# Altium project Low_Level_ECU.PrjPcb (part 3 of 6)

## Sheet 07-MCU PORTC_D.SchDoc: MCU2
size 420 x 297 mm; Revision: 1.0; SheetNumber: 7; SheetTotal: 13; Project: LOW LEVEL ECU
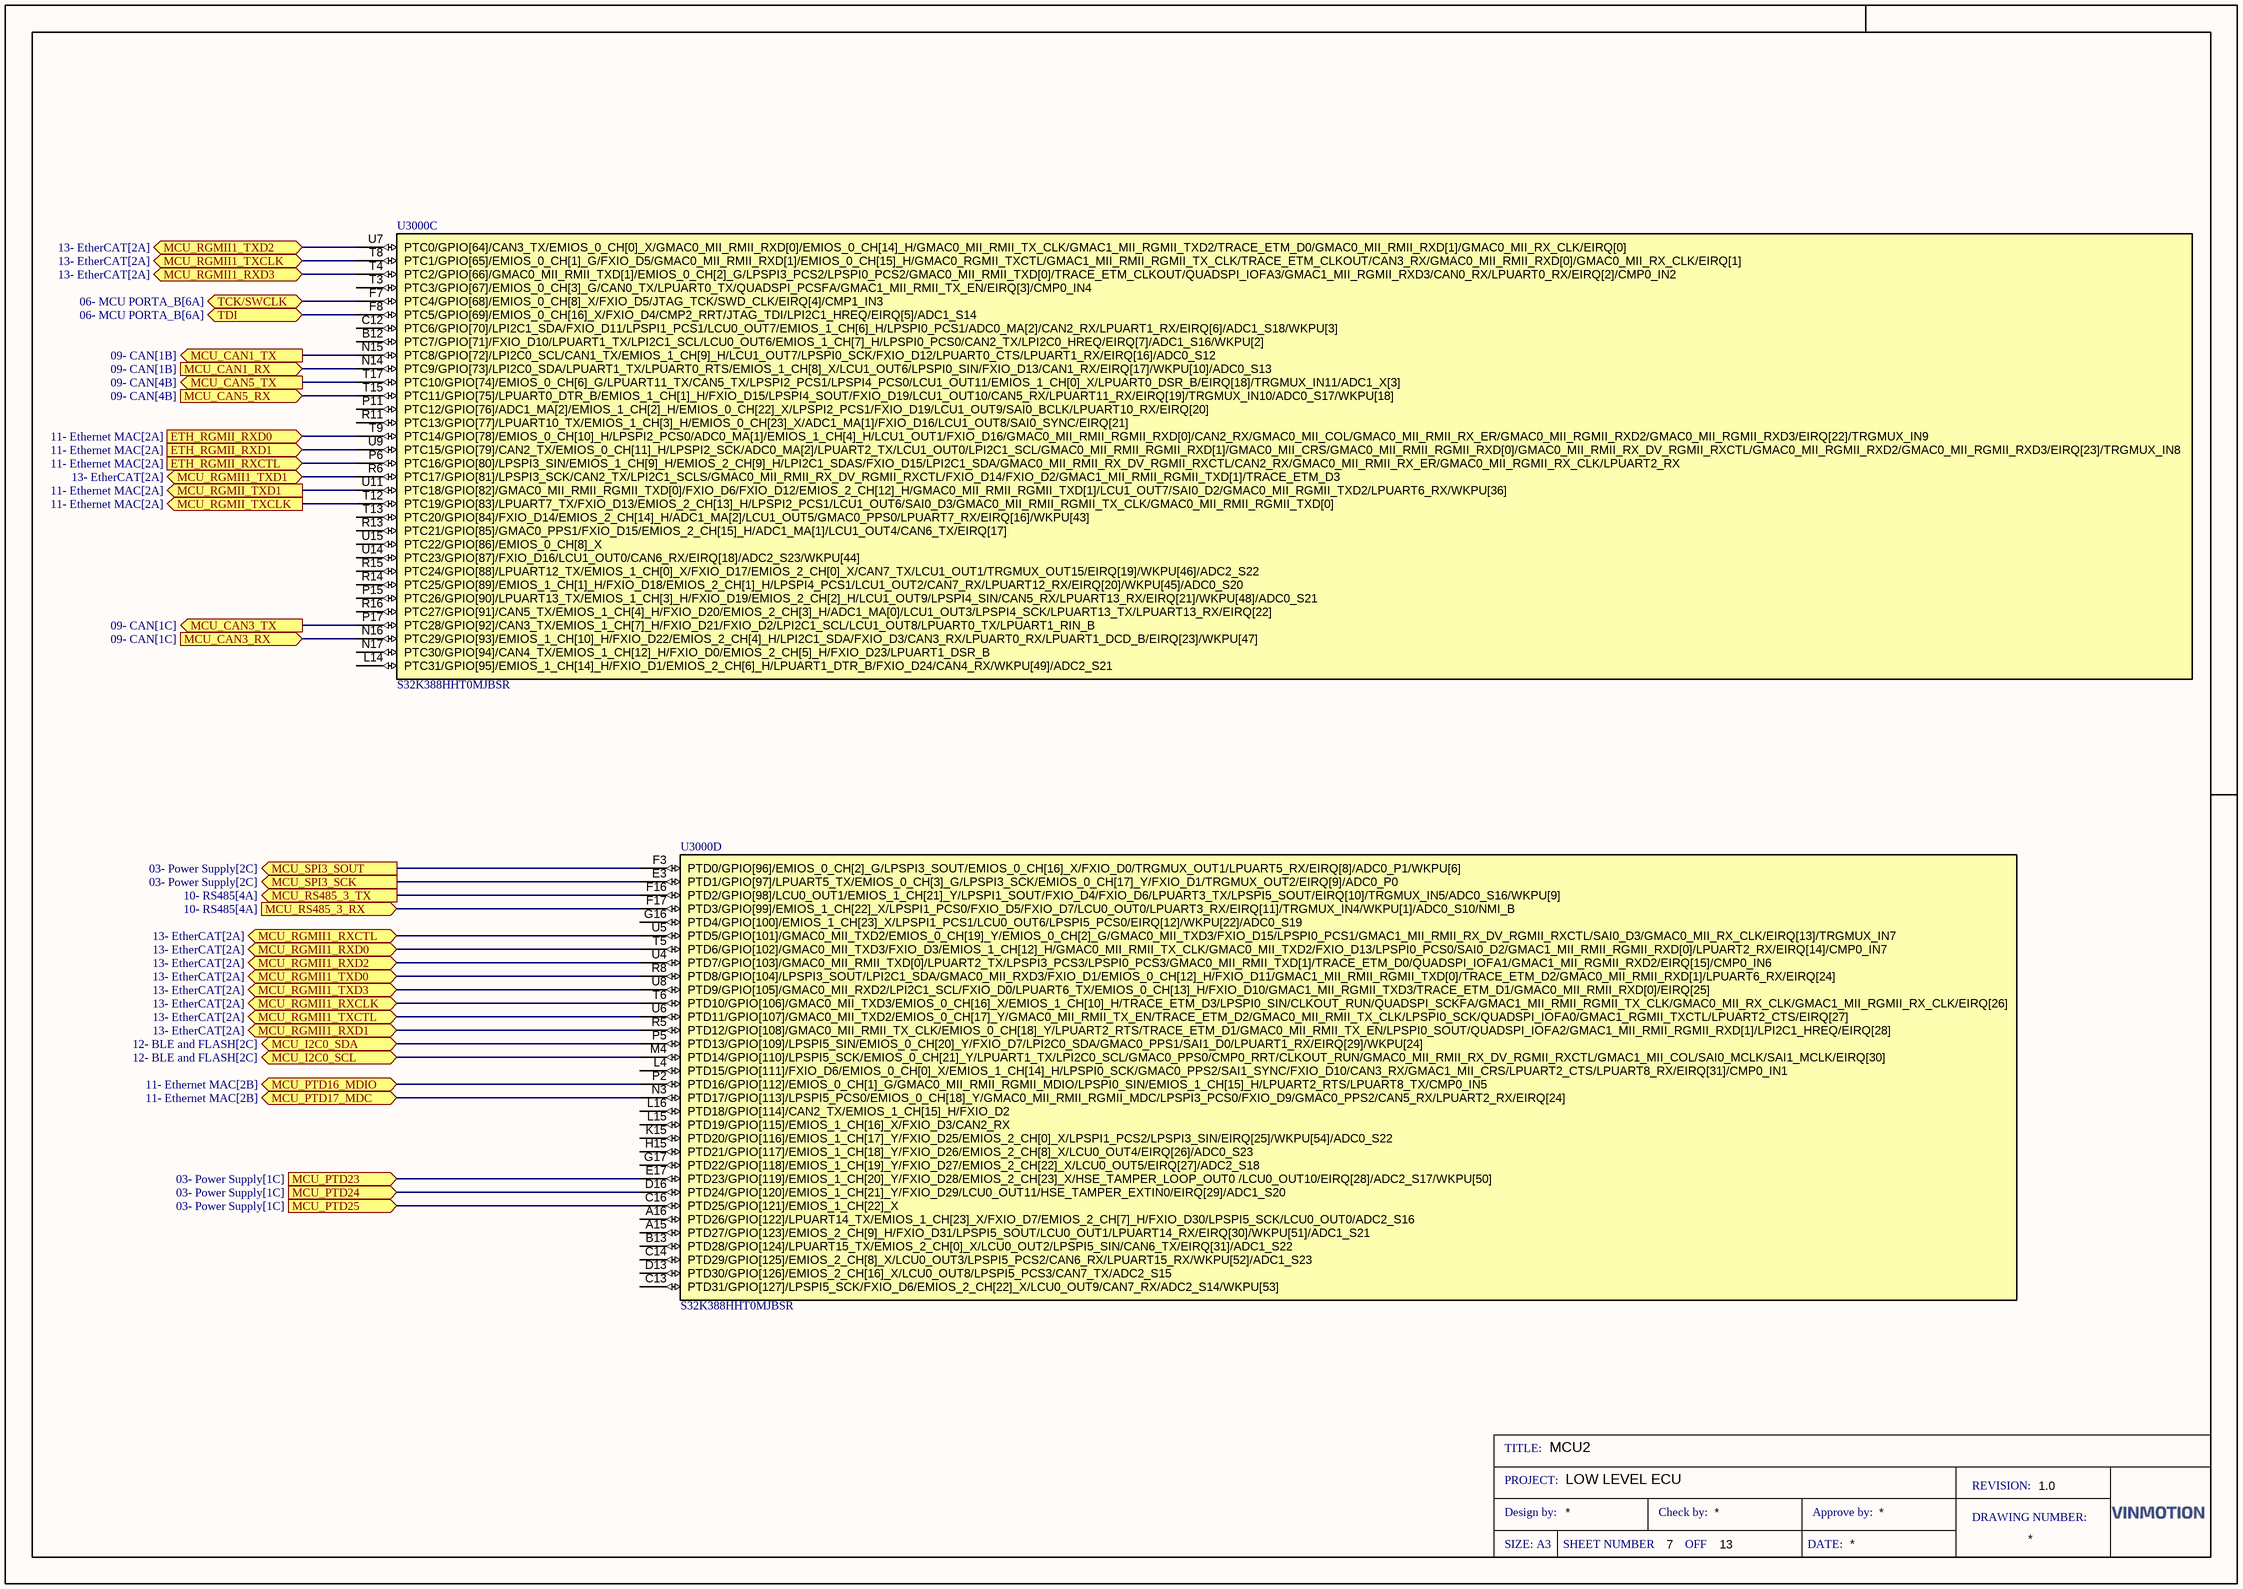
[diagram p5: 07-MCU PORTC_D.SchDoc]

### Parts
U3000  S32K388HHT0MJBSR  [BGA289C80P17X17_1400X1400X152]  (parts C,D of 9)

### Ports
ETH_RGMII_RXCTL (in, see 11- Ethernet MAC[2A]), ETH_RGMII_RXD0 (in, see 11- Ethernet MAC[2A]), ETH_RGMII_RXD1 (in, see 11- Ethernet MAC[2A]), MCU_CAN1_RX (in, see 09- CAN[1B]), MCU_CAN1_TX (out, see 09- CAN[1B]), MCU_CAN3_RX (in, see 09- CAN[1C]), MCU_CAN3_TX (out, see 09- CAN[1C]), MCU_CAN5_RX (in, see 09- CAN[4B]), MCU_CAN5_TX (out, see 09- CAN[4B]), MCU_I2C0_SCL (bidir, see 12- BLE and FLASH[2C]), MCU_I2C0_SDA (bidir, see 12- BLE and FLASH[2C]), MCU_PTD16_MDIO (bidir, see 11- Ethernet MAC[2B]), MCU_PTD17_MDC (bidir, see 11- Ethernet MAC[2B]), MCU_PTD23 (in, see 03- Power Supply[1C]), MCU_PTD24 (in, see 03- Power Supply[1C]), MCU_PTD25 (in, see 03- Power Supply[1C]), MCU_RGMII1_RXCLK (bidir, see 13- EtherCAT[2A]), MCU_RGMII1_RXCTL (bidir, see 13- EtherCAT[2A]), MCU_RGMII1_RXD0 (bidir, see 13- EtherCAT[2A]), MCU_RGMII1_RXD1 (bidir, see 13- EtherCAT[2A]), MCU_RGMII1_RXD2 (bidir, see 13- EtherCAT[2A]), MCU_RGMII1_RXD3 (bidir, see 13- EtherCAT[2A]), MCU_RGMII1_TXCLK (bidir, see 13- EtherCAT[2A]), MCU_RGMII1_TXCTL (bidir, see 13- EtherCAT[2A]), MCU_RGMII1_TXD0 (bidir, see 13- EtherCAT[2A]), MCU_RGMII1_TXD1 (bidir, see 13- EtherCAT[2A]), MCU_RGMII1_TXD2 (bidir, see 13- EtherCAT[2A]), MCU_RGMII1_TXD3 (bidir, see 13- EtherCAT[2A]), MCU_RGMII_TXCLK (out, see 11- Ethernet MAC[2A]), MCU_RGMII_TXD1 (out, see 11- Ethernet MAC[2A]), MCU_RS485_3_RX (in, see 10- RS485[4A]), MCU_RS485_3_TX (out, see 10- RS485[4A]), MCU_SPI3_SCK (out, see 03- Power Supply[2C]), MCU_SPI3_SOUT (out, see 03- Power Supply[2C]), TCK/SWCLK (bidir, see 06- MCU PORTA_B[6A]), TDI (bidir, see 06- MCU PORTA_B[6A])

### Nets
TCK/SWCLK: U3000.F7(PTC4/GPIO[68]/EMIOS_0_CH[8]_X/FXIO_D5/JTAG_TCK/SWD_CLK/EIRQ[4]/CMP1_IN3) ; port TCK/SWCLK
TDI: U3000.F8(PTC5/GPIO[69]/EMIOS_0_CH[16]_X/FXIO_D4/CMP2_RRT/JTAG_TDI/LPI2C1_HREQ/EIRQ[5]/ADC1_S14) ; port TDI
NetC1045_1: U3000.E17(PTD23/GPIO[119]/EMIOS_1_CH[20]_Y/FXIO_D28/EMIOS_2_CH[23]_X/HSE_TAMPER_LOOP_OUT0_/LCU0_OUT10/EIRQ[28]/ADC2_S17/WKPU[50]) ; port MCU_PTD23
NetC1046_1: U3000.D16(PTD24/GPIO[120]/EMIOS_1_CH[21]_Y/FXIO_D29/LCU0_OUT11/HSE_TAMPER_EXTIN0/EIRQ[29]/ADC1_S20) ; port MCU_PTD24
NetC1048_1: U3000.C16(PTD25/GPIO[121]/EMIOS_1_CH[22]_X) ; port MCU_PTD25
NetR1012_1: U3000.F3(PTD0/GPIO[96]/EMIOS_0_CH[2]_G/LPSPI3_SOUT/EMIOS_0_CH[16]_X/FXIO_D0/TRGMUX_OUT1/LPUART5_RX/EIRQ[8]/ADC0_P1/WKPU[6]) ; port MCU_SPI3_SOUT
NetR1013_1: U3000.E3(PTD1/GPIO[97]/LPUART5_TX/EMIOS_0_CH[3]_G/LPSPI3_SCK/EMIOS_0_CH[17]_Y/FXIO_D1/TRGMUX_OUT2/EIRQ[9]/ADC0_P0) ; port MCU_SPI3_SCK
NetR6001_1: U3000.P6(PTC16/GPIO[80]/LPSPI3_SIN/EMIOS_1_CH[9]_H/EMIOS_2_CH[9]_H/LPI2C1_SDAS/FXIO_D15/LPI2C1_SDA/GMAC0_MII_RMII_RX_DV_RGMII_RXCTL/CAN2_RX/GMAC0_MII_RMII_RX_ER/GMAC0_MII_RGMII_RX_CLK/LPUART2_RX) ; port ETH_RGMII_RXCTL
NetR6004_1: U3000.U9(PTC15/GPIO[79]/CAN2_TX/EMIOS_0_CH[11]_H/LPSPI2_SCK/ADC0_MA[2]/LPUART2_TX/LCU1_OUT0/LPI2C1_SCL/GMAC0_MII_RMII_RGMII_RXD[1]/GMAC0_MII_CRS/GMAC0_MII_RMII_RGMII_RXD[0]/GMAC0_MII_RMII_RX_DV_RGMII_RXCTL/GMAC0_MII_RGMII_RXD2/GMAC0_MII_RGMII_RXD3/EIRQ[23]/TRGMUX_IN8) ; port ETH_RGMII_RXD1
NetR6005_1: U3000.T9(PTC14/GPIO[78]/EMIOS_0_CH[10]_H/LPSPI2_PCS0/ADC0_MA[1]/EMIOS_1_CH[4]_H/LCU1_OUT1/FXIO_D16/GMAC0_MII_RMII_RGMII_RXD[0]/CAN2_RX/GMAC0_MII_COL/GMAC0_MII_RMII_RX_ER/GMAC0_MII_RGMII_RXD2/GMAC0_MII_RGMII_RXD3/EIRQ[22]/TRGMUX_IN9) ; port ETH_RGMII_RXD0
NetR6006_1: U3000.T12(PTC19/GPIO[83]/LPUART7_TX/FXIO_D13/EMIOS_2_CH[13]_H/LPSPI2_PCS1/LCU1_OUT6/SAI0_D3/GMAC0_MII_RMII_RGMII_TX_CLK/GMAC0_MII_RMII_RGMII_TXD[0]) ; port MCU_RGMII_TXCLK
NetR6010_1: U3000.U11(PTC18/GPIO[82]/GMAC0_MII_RMII_RGMII_TXD[0]/FXIO_D6/FXIO_D12/EMIOS_2_CH[12]_H/GMAC0_MII_RMII_RGMII_TXD[1]/LCU1_OUT7/SAI0_D2/GMAC0_MII_RGMII_TXD2/LPUART6_RX/WKPU[36]) ; port MCU_RGMII_TXD1
NetR6017_1: U3000.P2(PTD16/GPIO[112]/EMIOS_0_CH[1]_G/GMAC0_MII_RMII_RGMII_MDIO/LPSPI0_SIN/EMIOS_1_CH[15]_H/LPUART2_RTS/LPUART8_TX/CMP0_IN5) ; port MCU_PTD16_MDIO
NetR6021_1: U3000.N3(PTD17/GPIO[113]/LPSPI5_PCS0/EMIOS_0_CH[18]_Y/GMAC0_MII_RMII_RGMII_MDC/LPSPI3_PCS0/FXIO_D9/GMAC0_PPS2/CAN5_RX/LPUART2_RX/EIRQ[24]) ; port MCU_PTD17_MDC
NetR7016_1: U3000.P5(PTD13/GPIO[109]/LPSPI5_SIN/EMIOS_0_CH[20]_Y/FXIO_D7/LPI2C0_SDA/GMAC0_PPS1/SAI1_D0/LPUART1_RX/EIRQ[29]/WKPU[24]) ; port MCU_I2C0_SDA
NetR7017_1: U3000.M4(PTD14/GPIO[110]/LPSPI5_SCK/EMIOS_0_CH[21]_Y/LPUART1_TX/LPI2C0_SCL/GMAC0_PPS0/CMP0_RRT/CLKOUT_RUN/GMAC0_MII_RMII_RX_DV_RGMII_RXCTL/GMAC1_MII_COL/SAI0_MCLK/SAI1_MCLK/EIRQ[30]) ; port MCU_I2C0_SCL
NetR8000_1: U3000.T8(PTC1/GPIO[65]/EMIOS_0_CH[1]_G/FXIO_D5/GMAC0_MII_RMII_RXD[1]/EMIOS_0_CH[15]_H/GMAC0_RGMII_TXCTL/GMAC1_MII_RMII_RGMII_TX_CLK/TRACE_ETM_CLKOUT/CAN3_RX/GMAC0_MII_RMII_RXD[0]/GMAC0_MII_RX_CLK/EIRQ[1]) ; port MCU_RGMII1_TXCLK
NetR8001_1: U3000.U6(PTD11/GPIO[107]/GMAC0_MII_TXD2/EMIOS_0_CH[17]_Y/GMAC0_MII_RMII_TX_EN/TRACE_ETM_D2/GMAC0_MII_RMII_TX_CLK/LPSPI0_SCK/QUADSPI_IOFA0/GMAC1_RGMII_TXCTL/LPUART2_CTS/EIRQ[27]) ; port MCU_RGMII1_TXCTL
NetR8002_1: U3000.R8(PTD8/GPIO[104]/LPSPI3_SOUT/LPI2C1_SDA/GMAC0_MII_RXD3/FXIO_D1/EMIOS_0_CH[12]_H/FXIO_D11/GMAC1_MII_RMII_RGMII_TXD[0]/TRACE_ETM_D2/GMAC0_MII_RMII_RXD[1]/LPUART6_RX/EIRQ[24]) ; port MCU_RGMII1_TXD0
NetR8003_1: U3000.R6(PTC17/GPIO[81]/LPSPI3_SCK/CAN2_TX/LPI2C1_SCLS/GMAC0_MII_RMII_RX_DV_RGMII_RXCTL/FXIO_D14/FXIO_D2/GMAC1_MII_RMII_RGMII_TXD[1]/TRACE_ETM_D3) ; port MCU_RGMII1_TXD1
NetR8004_1: U3000.U7(PTC0/GPIO[64]/CAN3_TX/EMIOS_0_CH[0]_X/GMAC0_MII_RMII_RXD[0]/EMIOS_0_CH[14]_H/GMAC0_MII_RMII_TX_CLK/GMAC1_MII_RGMII_TXD2/TRACE_ETM_D0/GMAC0_MII_RMII_RXD[1]/GMAC0_MII_RX_CLK/EIRQ[0]) ; port MCU_RGMII1_TXD2
NetR8005_1: U3000.U8(PTD9/GPIO[105]/GMAC0_MII_RXD2/LPI2C1_SCL/FXIO_D0/LPUART6_TX/EMIOS_0_CH[13]_H/FXIO_D10/GMAC1_MII_RGMII_TXD3/TRACE_ETM_D1/GMAC0_MII_RMII_RXD[0]/EIRQ[25]) ; port MCU_RGMII1_TXD3
NetR8006_1: U3000.T6(PTD10/GPIO[106]/GMAC0_MII_TXD3/EMIOS_0_CH[16]_X/EMIOS_1_CH[10]_H/TRACE_ETM_D3/LPSPI0_SIN/CLKOUT_RUN/QUADSPI_SCKFA/GMAC1_MII_RMII_RGMII_TX_CLK/GMAC0_MII_RX_CLK/GMAC1_MII_RGMII_RX_CLK/EIRQ[26]) ; port MCU_RGMII1_RXCLK
NetR8007_1: U3000.U5(PTD5/GPIO[101]/GMAC0_MII_TXD2/EMIOS_0_CH[19]_Y/EMIOS_0_CH[2]_G/GMAC0_MII_TXD3/FXIO_D15/LPSPI0_PCS1/GMAC1_MII_RMII_RX_DV_RGMII_RXCTL/SAI0_D3/GMAC0_MII_RX_CLK/EIRQ[13]/TRGMUX_IN7) ; port MCU_RGMII1_RXCTL
NetR8008_1: U3000.T5(PTD6/GPIO[102]/GMAC0_MII_TXD3/FXIO_D3/EMIOS_1_CH[12]_H/GMAC0_MII_RMII_TX_CLK/GMAC0_MII_TXD2/FXIO_D13/LPSPI0_PCS0/SAI0_D2/GMAC1_MII_RMII_RGMII_RXD[0]/LPUART2_RX/EIRQ[14]/CMP0_IN7) ; port MCU_RGMII1_RXD0
NetR8009_1: U3000.R5(PTD12/GPIO[108]/GMAC0_MII_RMII_TX_CLK/EMIOS_0_CH[18]_Y/LPUART2_RTS/TRACE_ETM_D1/GMAC0_MII_RMII_TX_EN/LPSPI0_SOUT/QUADSPI_IOFA2/GMAC1_MII_RMII_RGMII_RXD[1]/LPI2C1_HREQ/EIRQ[28]) ; port MCU_RGMII1_RXD1
NetR8010_1: U3000.U4(PTD7/GPIO[103]/GMAC0_MII_RMII_TXD[0]/LPUART2_TX/LPSPI3_PCS3/LPSPI0_PCS3/GMAC0_MII_RMII_TXD[1]/TRACE_ETM_D0/QUADSPI_IOFA1/GMAC1_MII_RGMII_RXD2/EIRQ[15]/CMP0_IN6) ; port MCU_RGMII1_RXD2
NetR8011_1: U3000.T4(PTC2/GPIO[66]/GMAC0_MII_RMII_TXD[1]/EMIOS_0_CH[2]_G/LPSPI3_PCS2/LPSPI0_PCS2/GMAC0_MII_RMII_TXD[0]/TRACE_ETM_CLKOUT/QUADSPI_IOFA3/GMAC1_MII_RGMII_RXD3/CAN0_RX/LPUART0_RX/EIRQ[2]/CMP0_IN2) ; port MCU_RGMII1_RXD3
NetU3000_F16: U3000.F16(PTD2/GPIO[98]/LCU0_OUT1/EMIOS_1_CH[21]_Y/LPSPI1_SOUT/FXIO_D4/FXIO_D6/LPUART3_TX/LPSPI5_SOUT/EIRQ[10]/TRGMUX_IN5/ADC0_S16/WKPU[9]) ; port MCU_RS485_3_TX
NetU3000_F17: U3000.F17(PTD3/GPIO[99]/EMIOS_1_CH[22]_X/LPSPI1_PCS0/FXIO_D5/FXIO_D7/LCU0_OUT0/LPUART3_RX/EIRQ[11]/TRGMUX_IN4/WKPU[1]/ADC0_S10/NMI_B) ; port MCU_RS485_3_RX
NetU3000_N14: U3000.N14(PTC9/GPIO[73]/LPI2C0_SDA/LPUART1_TX/LPUART0_RTS/EMIOS_1_CH[8]_X/LCU1_OUT6/LPSPI0_SIN/FXIO_D13/CAN1_RX/EIRQ[17]/WKPU[10]/ADC0_S13) ; port MCU_CAN1_RX
NetU3000_N15: U3000.N15(PTC8/GPIO[72]/LPI2C0_SCL/CAN1_TX/EMIOS_1_CH[9]_H/LCU1_OUT7/LPSPI0_SCK/FXIO_D12/LPUART0_CTS/LPUART1_RX/EIRQ[16]/ADC0_S12) ; port MCU_CAN1_TX
NetU3000_N16: U3000.N16(PTC29/GPIO[93]/EMIOS_1_CH[10]_H/FXIO_D22/EMIOS_2_CH[4]_H/LPI2C1_SDA/FXIO_D3/CAN3_RX/LPUART0_RX/LPUART1_DCD_B/EIRQ[23]/WKPU[47]) ; port MCU_CAN3_RX
NetU3000_P17: U3000.P17(PTC28/GPIO[92]/CAN3_TX/EMIOS_1_CH[7]_H/FXIO_D21/FXIO_D2/LPI2C1_SCL/LCU1_OUT8/LPUART0_TX/LPUART1_RIN_B) ; port MCU_CAN3_TX
NetU3000_T15: U3000.T15(PTC11/GPIO[75]/LPUART0_DTR_B/EMIOS_1_CH[1]_H/FXIO_D15/LPSPI4_SOUT/FXIO_D19/LCU1_OUT10/CAN5_RX/LPUART11_RX/EIRQ[19]/TRGMUX_IN10/ADC0_S17/WKPU[18]) ; port MCU_CAN5_RX
NetU3000_T17: U3000.T17(PTC10/GPIO[74]/EMIOS_0_CH[6]_G/LPUART11_TX/CAN5_TX/LPSPI2_PCS1/LPSPI4_PCS0/LCU1_OUT11/EMIOS_1_CH[0]_X/LPUART0_DSR_B/EIRQ[18]/TRGMUX_IN11/ADC1_X[3]) ; port MCU_CAN5_TX

Not connected (* = marked no-connect by the designer): U3000 A15(PTD27/GPIO[123]/EMIOS_2_CH[9]_H/FXIO_D31/LPSPI5_SOUT/LCU0_OUT1/LPUART14_RX/EIRQ[30]/WKPU[51]/ADC1_S21) A16(PTD26/GPIO[122]/LPUART14_TX/EMIOS_1_CH[23]_X/FXIO_D7/EMIOS_2_CH[7]_H/FXIO_D30/LPSPI5_SCK/LCU0_OUT0/ADC2_S16) B12(PTC7/GPIO[71]/FXIO_D10/LPUART1_TX/LPI2C1_SCL/LCU0_OUT6/EMIOS_1_CH[7]_H/LPSPI0_PCS0/CAN2_TX/LPI2C0_HREQ/EIRQ[7]/ADC1_S16/WKPU[2]) B13(PTD28/GPIO[124]/LPUART15_TX/EMIOS_2_CH[0]_X/LCU0_OUT2/LPSPI5_SIN/CAN6_TX/EIRQ[31]/ADC1_S22) C12(PTC6/GPIO[70]/LPI2C1_SDA/FXIO_D11/LPSPI1_PCS1/LCU0_OUT7/EMIOS_1_CH[6]_H/LPSPI0_PCS1/ADC0_MA[2]/CAN2_RX/LPUART1_RX/EIRQ[6]/ADC1_S18/WKPU[3]) C13(PTD31/GPIO[127]/LPSPI5_SCK/FXIO_D6/EMIOS_2_CH[22]_X/LCU0_OUT9/CAN7_RX/ADC2_S14/WKPU[53]) C14(PTD29/GPIO[125]/EMIOS_2_CH[8]_X/LCU0_OUT3/LPSPI5_PCS2/CAN6_RX/LPUART15_RX/WKPU[52]/ADC1_S23) D13(PTD30/GPIO[126]/EMIOS_2_CH[16]_X/LCU0_OUT8/LPSPI5_PCS3/CAN7_TX/ADC2_S15) G16(PTD4/GPIO[100]/EMIOS_1_CH[23]_X/LPSPI1_PCS1/LCU0_OUT6/LPSPI5_PCS0/EIRQ[12]/WKPU[22]/ADC0_S19) G17(PTD22/GPIO[118]/EMIOS_1_CH[19]_Y/FXIO_D27/EMIOS_2_CH[22]_X/LCU0_OUT5/EIRQ[27]/ADC2_S18) H15(PTD21/GPIO[117]/EMIOS_1_CH[18]_Y/FXIO_D26/EMIOS_2_CH[8]_X/LCU0_OUT4/EIRQ[26]/ADC0_S23) K15(PTD20/GPIO[116]/EMIOS_1_CH[17]_Y/FXIO_D25/EMIOS_2_CH[0]_X/LPSPI1_PCS2/LPSPI3_SIN/EIRQ[25]/WKPU[54]/ADC0_S22) L4(PTD15/GPIO[111]/FXIO_D6/EMIOS_0_CH[0]_X/EMIOS_1_CH[14]_H/LPSPI0_SCK/GMAC0_PPS2/SAI1_SYNC/FXIO_D10/CAN3_RX/GMAC1_MII_CRS/LPUART2_CTS/LPUART8_RX/EIRQ[31]/CMP0_IN1) L14(PTC31/GPIO[95]/EMIOS_1_CH[14]_H/FXIO_D1/EMIOS_2_CH[6]_H/LPUART1_DTR_B/FXIO_D24/CAN4_RX/WKPU[49]/ADC2_S21) L15(PTD19/GPIO[115]/EMIOS_1_CH[16]_X/FXIO_D3/CAN2_RX) L16(PTD18/GPIO[114]/CAN2_TX/EMIOS_1_CH[15]_H/FXIO_D2) N17(PTC30/GPIO[94]/CAN4_TX/EMIOS_1_CH[12]_H/FXIO_D0/EMIOS_2_CH[5]_H/FXIO_D23/LPUART1_DSR_B) P11(PTC12/GPIO[76]/ADC1_MA[2]/EMIOS_1_CH[2]_H/EMIOS_0_CH[22]_X/LPSPI2_PCS1/FXIO_D19/LCU1_OUT9/SAI0_BCLK/LPUART10_RX/EIRQ[20]) P15(PTC26/GPIO[90]/LPUART13_TX/EMIOS_1_CH[3]_H/FXIO_D19/EMIOS_2_CH[2]_H/LCU1_OUT9/LPSPI4_SIN/CAN5_RX/LPUART13_RX/EIRQ[21]/WKPU[48]/ADC0_S21) R11(PTC13/GPIO[77]/LPUART10_TX/EMIOS_1_CH[3]_H/EMIOS_0_CH[23]_X/ADC1_MA[1]/FXIO_D16/LCU1_OUT8/SAI0_SYNC/EIRQ[21]) R13(PTC21/GPIO[85]/GMAC0_PPS1/FXIO_D15/EMIOS_2_CH[15]_H/ADC1_MA[1]/LCU1_OUT4/CAN6_TX/EIRQ[17]) R14(PTC25/GPIO[89]/EMIOS_1_CH[1]_H/FXIO_D18/EMIOS_2_CH[1]_H/LPSPI4_PCS1/LCU1_OUT2/CAN7_RX/LPUART12_RX/EIRQ[20]/WKPU[45]/ADC0_S20) R15(PTC24/GPIO[88]/LPUART12_TX/EMIOS_1_CH[0]_X/FXIO_D17/EMIOS_2_CH[0]_X/CAN7_TX/LCU1_OUT1/TRGMUX_OUT15/EIRQ[19]/WKPU[46]/ADC2_S22) R16(PTC27/GPIO[91]/CAN5_TX/EMIOS_1_CH[4]_H/FXIO_D20/EMIOS_2_CH[3]_H/ADC1_MA[0]/LCU1_OUT3/LPSPI4_SCK/LPUART13_TX/LPUART13_RX/EIRQ[22]) T3(PTC3/GPIO[67]/EMIOS_0_CH[3]_G/CAN0_TX/LPUART0_TX/QUADSPI_PCSFA/GMAC1_MII_RMII_TX_EN/EIRQ[3]/CMP0_IN4) T13(PTC20/GPIO[84]/FXIO_D14/EMIOS_2_CH[14]_H/ADC1_MA[2]/LCU1_OUT5/GMAC0_PPS0/LPUART7_RX/EIRQ[16]/WKPU[43]) U14(PTC23/GPIO[87]/FXIO_D16/LCU1_OUT0/CAN6_RX/EIRQ[18]/ADC2_S23/WKPU[44]) U15(PTC22/GPIO[86]/EMIOS_0_CH[8]_X)

### Notes on the sheet
- TITLE:
- PROJECT:
- Design by:
- Check by:
- Approve by:
- DRAWING NUMBER:
- REVISION:
- SIZE: A3
- SHEET NUMBER
- OFF
- DATE:

### Library data of the parts
U3000 = CMP-01150-1: ARM® Cortex®-M7F S32K3 Microcontroller IC 32-Bit 5-Core 320MHz 8MB (8M x 8) FLASH 289-LFBGA (14x14); Manufacturer: NXP Semiconductors; Category: Microcontrollers; Manufacturer Part Number: S32K388HHT0MJBSR

## Sheet 08- MCU PORTE_F_G.SchDoc: MCU1
size 420 x 297 mm; Revision: 1.0; SheetNumber: 8; SheetTotal: 13; Project: LOW LEVEL ECU
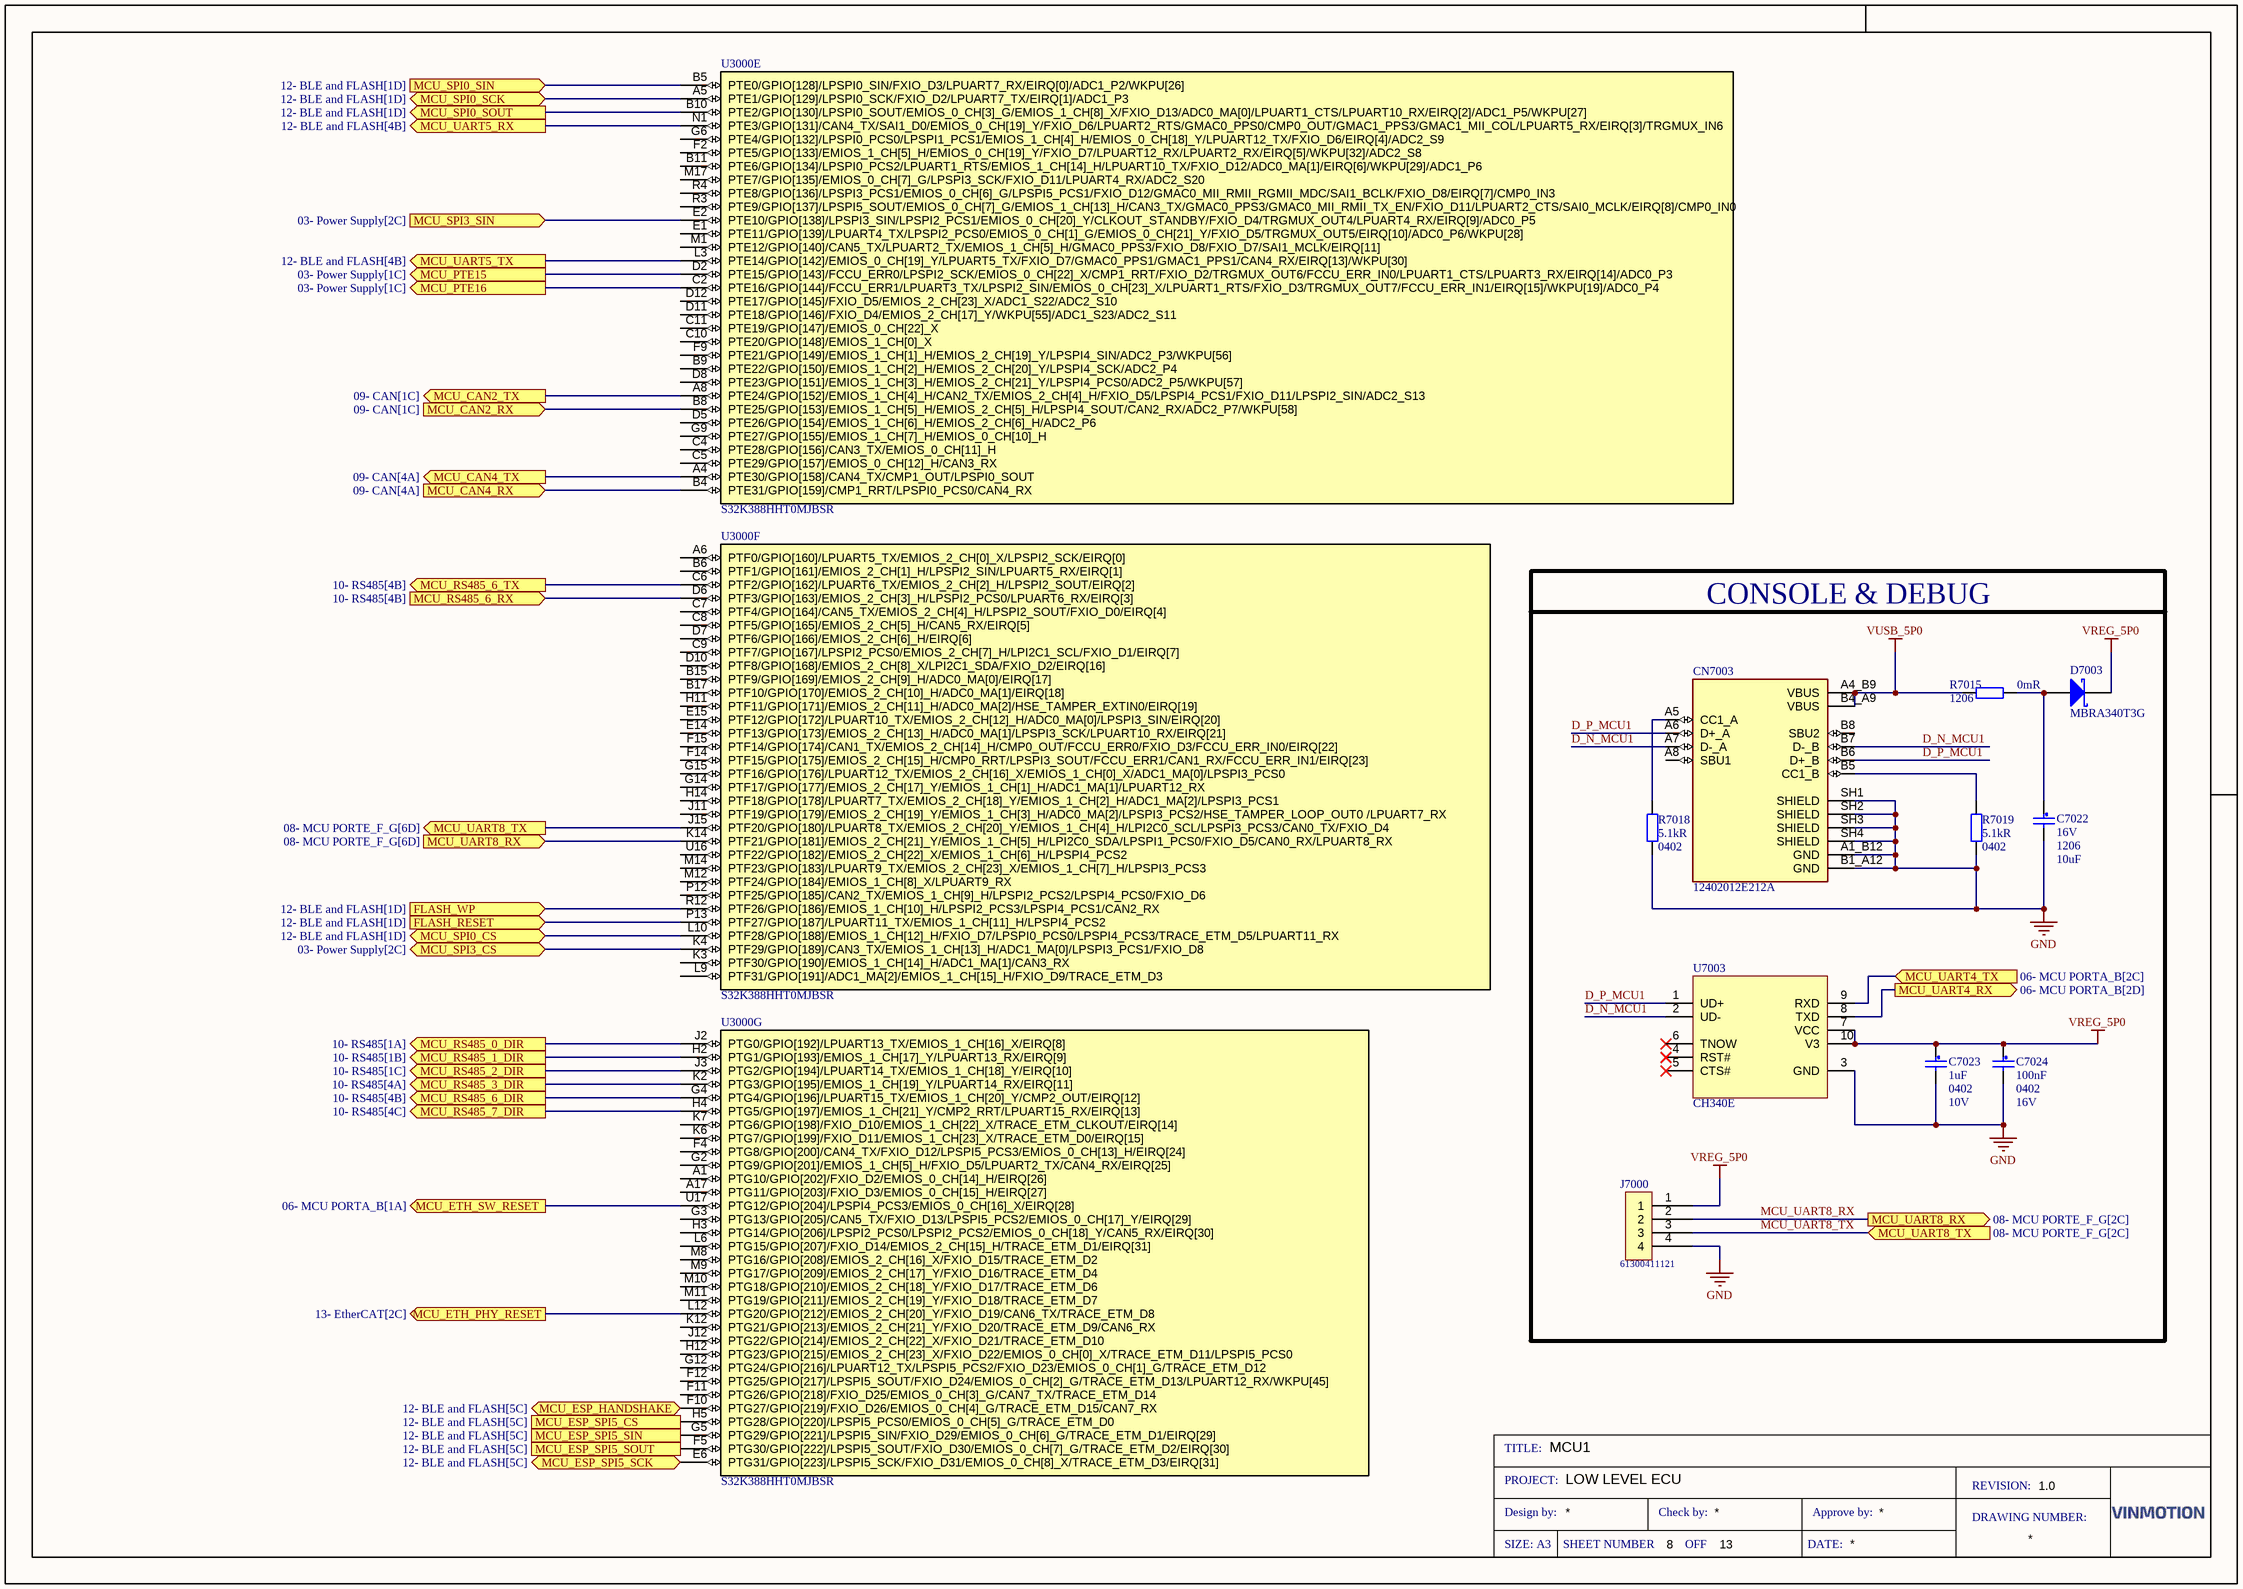
[diagram p6: 08- MCU PORTE_F_G.SchDoc]

### Parts
C7022  Voltage Rating: 16V  Case/Package: 1206  Capacitance: 10uF  [CAP1206]  (hidden comment: CL31B106KOHVPNE)
C7023  value 1uF  Case/Package: 0402  Rated DC Voltage (URdc): 10V  [CAP0402]  (hidden comment: CL05X105KP5NNNC)
C7024  Capacitance: 100nF  Case/Package: 0402  Voltage Rating (DC): 16V  [CAP0402]  (hidden comment: 0402YC104KAT2A)
CN7003  12402012E212A  [USB_TYPE_C]
D7003  MBRA340T3G  [ON_SMA_NRVBA340T3G_N]
J7000  61300411121  [WURTH_61300411121_R]
R7015  Resistance: 0mR  Case/Package: 1206  [RES1206]  (hidden comment: AC1206JR-070RL)
R7018  Resistance: 5.1kR  Case/Package: 0402  [RES0402]  (hidden comment: MCR01MZPF5101)
R7019  Resistance: 5.1kR  Case/Package: 0402  [RES0402]  (hidden comment: MCR01MZPF5101)
U3000  S32K388HHT0MJBSR  [BGA289C80P17X17_1400X1400X152]  (parts E,F,G of 9)
U7003  CH340E  [CH340E]

### Blocks framed on the sheet
CONSOLE & DEBUG: C7022-C7024 CN7003 D7003 J7000 R7015 R7018 R7019 U7003

### Ports
FLASH_RESET (in, see 12- BLE and FLASH[1D]), FLASH_WP (in, see 12- BLE and FLASH[1D]), MCU_CAN2_RX (in, see 09- CAN[1C]), MCU_CAN2_TX (out, see 09- CAN[1C]), MCU_CAN4_RX (in, see 09- CAN[4A]), MCU_CAN4_TX (out, see 09- CAN[4A]), MCU_ESP_HANDSHAKE (bidir, see 12- BLE and FLASH[5C]), MCU_ESP_SPI5_CS (out, see 12- BLE and FLASH[5C]), MCU_ESP_SPI5_SCK (bidir, see 12- BLE and FLASH[5C]), MCU_ESP_SPI5_SIN (in, see 12- BLE and FLASH[5C]), MCU_ESP_SPI5_SOUT (out, see 12- BLE and FLASH[5C]), MCU_ETH_PHY_RESET (out, see 13- EtherCAT[2C]), MCU_ETH_SW_RESET (out, see 06- MCU PORTA_B[1A]), MCU_PTE15 (out, see 03- Power Supply[1C]), MCU_PTE16 (out, see 03- Power Supply[1C]), MCU_RS485_0_DIR (out, see 10- RS485[1A]), MCU_RS485_1_DIR (out, see 10- RS485[1B]), MCU_RS485_2_DIR (out, see 10- RS485[1C]), MCU_RS485_3_DIR (out, see 10- RS485[4A]), MCU_RS485_6_DIR (out, see 10- RS485[4B]), MCU_RS485_6_RX (in, see 10- RS485[4B]), MCU_RS485_6_TX (out, see 10- RS485[4B]), MCU_RS485_7_DIR (out, see 10- RS485[4C]), MCU_SPI0_CS (bidir, see 12- BLE and FLASH[1D]), MCU_SPI0_SCK (bidir, see 12- BLE and FLASH[1D]), MCU_SPI0_SIN (in, see 12- BLE and FLASH[1D]), MCU_SPI0_SOUT (out, see 12- BLE and FLASH[1D]), MCU_SPI3_CS (bidir, see 03- Power Supply[2C]), MCU_SPI3_SIN (in, see 03- Power Supply[2C]), MCU_UART4_RX (out, see 06- MCU PORTA_B[2D]), MCU_UART4_TX (in, see 06- MCU PORTA_B[2C]), MCU_UART5_RX (out, see 12- BLE and FLASH[4B]), MCU_UART5_TX (out, see 12- BLE and FLASH[4B]), MCU_UART8_RX (in, see 08- MCU PORTE_F_G[6D]), MCU_UART8_RX (out, see 08- MCU PORTE_F_G[2C]), MCU_UART8_TX (in, see 08- MCU PORTE_F_G[2C]), MCU_UART8_TX (out, see 08- MCU PORTE_F_G[6D])

### Nets
GND: C7022.2 C7023.2 C7024.2 CN7003.A1_B12(GND) CN7003.B1_A12(GND) CN7003.SH1(SHIELD) CN7003.SH2(SHIELD) CN7003.SH3(SHIELD) CN7003.SH4(SHIELD) J7000.4 R7018.1 R7019.1 U7003.3(GND)
VREG_5P0: C7023.1 C7024.1 D7003.1(K) J7000.1 U7003.7(VCC) U7003.10(V3)
VUSB_5P0: CN7003.A4_B9(VBUS) CN7003.B4_A9(VBUS) R7015.1
D_N_MCU1: CN7003.A7(D-_A) CN7003.B7(D-_B) U7003.2(UD-)
D_P_MCU1: CN7003.A6(D+_A) CN7003.B6(D+_B) U7003.1(UD+)
MCU_UART8_RX: J7000.2 U3000.K14(PTF21/GPIO[181]/EMIOS_2_CH[21]_Y/EMIOS_1_CH[5]_H/LPI2C0_SDA/LPSPI1_PCS0/FXIO_D5/CAN0_RX/LPUART8_RX) ; port MCU_UART8_RX
MCU_UART8_TX: J7000.3 U3000.J15(PTF20/GPIO[180]/LPUART8_TX/EMIOS_2_CH[20]_Y/EMIOS_1_CH[4]_H/LPI2C0_SCL/LPSPI3_PCS3/CAN0_TX/FXIO_D4) ; port MCU_UART8_TX
NetC7022_1: C7022.1 D7003.2(A) R7015.2
NetCN7003_A5: CN7003.A5(CC1_A) R7018.2
NetCN7003_B5: CN7003.B5(CC1_B) R7019.2
NetR1011_1: U3000.E2(PTE10/GPIO[138]/LPSPI3_SIN/LPSPI2_PCS1/EMIOS_0_CH[20]_Y/CLKOUT_STANDBY/FXIO_D4/TRGMUX_OUT4/LPUART4_RX/EIRQ[9]/ADC0_P5) ; port MCU_SPI3_SIN
NetR1014_1: U3000.K4(PTF29/GPIO[189]/CAN3_TX/EMIOS_1_CH[13]_H/ADC1_MA[0]/LPSPI3_PCS1/FXIO_D8) ; port MCU_SPI3_CS
NetR1015_1: U3000.C2(PTE16/GPIO[144]/FCCU_ERR1/LPUART3_TX/LPSPI2_SIN/EMIOS_0_CH[23]_X/LPUART1_RTS/FXIO_D3/TRGMUX_OUT7/FCCU_ERR_IN1/EIRQ[15]/WKPU[19]/ADC0_P4) ; port MCU_PTE16
NetR1028_2: U3000.D2(PTE15/GPIO[143]/FCCU_ERR0/LPSPI2_SCK/EMIOS_0_CH[22]_X/CMP1_RRT/FXIO_D2/TRGMUX_OUT6/FCCU_ERR_IN0/LPUART1_CTS/LPUART3_RX/EIRQ[14]/ADC0_P3) ; port MCU_PTE15
NetR3007_1: U3000.U17(PTG12/GPIO[204]/LPSPI4_PCS3/EMIOS_0_CH[16]_X/EIRQ[28]) ; port MCU_ETH_SW_RESET
NetR5002_2: U3000.J2(PTG0/GPIO[192]/LPUART13_TX/EMIOS_1_CH[16]_X/EIRQ[8]) ; port MCU_RS485_0_DIR
NetR5003_2: U3000.K2(PTG3/GPIO[195]/EMIOS_1_CH[19]_Y/LPUART14_RX/EIRQ[11]) ; port MCU_RS485_3_DIR
NetR5006_2: U3000.H2(PTG1/GPIO[193]/EMIOS_1_CH[17]_Y/LPUART13_RX/EIRQ[9]) ; port MCU_RS485_1_DIR
NetR5007_2: U3000.G4(PTG4/GPIO[196]/LPUART15_TX/EMIOS_1_CH[20]_Y/CMP2_OUT/EIRQ[12]) ; port MCU_RS485_6_DIR
NetR5010_2: U3000.J3(PTG2/GPIO[194]/LPUART14_TX/EMIOS_1_CH[18]_Y/EIRQ[10]) ; port MCU_RS485_2_DIR
NetR5011_2: U3000.H4(PTG5/GPIO[197]/EMIOS_1_CH[21]_Y/CMP2_RRT/LPUART15_RX/EIRQ[13]) ; port MCU_RS485_7_DIR
NetR8040_1: U3000.L12(PTG20/GPIO[212]/EMIOS_2_CH[20]_Y/FXIO_D19/CAN6_TX/TRACE_ETM_D8) ; port MCU_ETH_PHY_RESET
NetU3000_A4: U3000.A4(PTE30/GPIO[158]/CAN4_TX/CMP1_OUT/LPSPI0_SOUT) ; port MCU_CAN4_TX
NetU3000_A5: U3000.A5(PTE1/GPIO[129]/LPSPI0_SCK/FXIO_D2/LPUART7_TX/EIRQ[1]/ADC1_P3) ; port MCU_SPI0_SCK
NetU3000_A8: U3000.A8(PTE24/GPIO[152]/EMIOS_1_CH[4]_H/CAN2_TX/EMIOS_2_CH[4]_H/FXIO_D5/LPSPI4_PCS1/FXIO_D11/LPSPI2_SIN/ADC2_S13) ; port MCU_CAN2_TX
NetU3000_B4: U3000.B4(PTE31/GPIO[159]/CMP1_RRT/LPSPI0_PCS0/CAN4_RX) ; port MCU_CAN4_RX
NetU3000_B5: U3000.B5(PTE0/GPIO[128]/LPSPI0_SIN/FXIO_D3/LPUART7_RX/EIRQ[0]/ADC1_P2/WKPU[26]) ; port MCU_SPI0_SIN
NetU3000_B8: U3000.B8(PTE25/GPIO[153]/EMIOS_1_CH[5]_H/EMIOS_2_CH[5]_H/LPSPI4_SOUT/CAN2_RX/ADC2_P7/WKPU[58]) ; port MCU_CAN2_RX
NetU3000_B10: U3000.B10(PTE2/GPIO[130]/LPSPI0_SOUT/EMIOS_0_CH[3]_G/EMIOS_1_CH[8]_X/FXIO_D13/ADC0_MA[0]/LPUART1_CTS/LPUART10_RX/EIRQ[2]/ADC1_P5/WKPU[27]) ; port MCU_SPI0_SOUT
NetU3000_C6: U3000.C6(PTF2/GPIO[162]/LPUART6_TX/EMIOS_2_CH[2]_H/LPSPI2_SOUT/EIRQ[2]) ; port MCU_RS485_6_TX
NetU3000_D6: U3000.D6(PTF3/GPIO[163]/EMIOS_2_CH[3]_H/LPSPI2_PCS0/LPUART6_RX/EIRQ[3]) ; port MCU_RS485_6_RX
NetU3000_E6: U3000.E6(PTG31/GPIO[223]/LPSPI5_SCK/FXIO_D31/EMIOS_0_CH[8]_X/TRACE_ETM_D3/EIRQ[31]) ; port MCU_ESP_SPI5_SCK
NetU3000_F5: U3000.F5(PTG30/GPIO[222]/LPSPI5_SOUT/FXIO_D30/EMIOS_0_CH[7]_G/TRACE_ETM_D2/EIRQ[30]) ; port MCU_ESP_SPI5_SOUT
NetU3000_F10: U3000.F10(PTG27/GPIO[219]/FXIO_D26/EMIOS_0_CH[4]_G/TRACE_ETM_D15/CAN7_RX) ; port MCU_ESP_HANDSHAKE
NetU3000_G5: U3000.G5(PTG29/GPIO[221]/LPSPI5_SIN/FXIO_D29/EMIOS_0_CH[6]_G/TRACE_ETM_D1/EIRQ[29]) ; port MCU_ESP_SPI5_SIN
NetU3000_H5: U3000.H5(PTG28/GPIO[220]/LPSPI5_PCS0/EMIOS_0_CH[5]_G/TRACE_ETM_D0) ; port MCU_ESP_SPI5_CS
NetU3000_K16: U7003.8(TXD) ; port MCU_UART4_RX
NetU3000_K17: U7003.9(RXD) ; port MCU_UART4_TX
NetU3000_L3: U3000.L3(PTE14/GPIO[142]/EMIOS_0_CH[19]_Y/LPUART5_TX/FXIO_D7/GMAC0_PPS1/GMAC1_PPS1/CAN4_RX/EIRQ[13]/WKPU[30]) ; port MCU_UART5_TX
NetU3000_L10: U3000.L10(PTF28/GPIO[188]/EMIOS_1_CH[12]_H/FXIO_D7/LPSPI0_PCS0/LPSPI4_PCS3/TRACE_ETM_D5/LPUART11_RX) ; port MCU_SPI0_CS
NetU3000_N1: U3000.N1(PTE3/GPIO[131]/CAN4_TX/SAI1_D0/EMIOS_0_CH[19]_Y/FXIO_D6/LPUART2_RTS/GMAC0_PPS0/CMP0_OUT/GMAC1_PPS3/GMAC1_MII_COL/LPUART5_RX/EIRQ[3]/TRGMUX_IN6) ; port MCU_UART5_RX
NetU3000_P13: U3000.P13(PTF27/GPIO[187]/LPUART11_TX/EMIOS_1_CH[11]_H/LPSPI4_PCS2) ; port FLASH_RESET
NetU3000_R12: U3000.R12(PTF26/GPIO[186]/EMIOS_1_CH[10]_H/LPSPI2_PCS3/LPSPI4_PCS1/CAN2_RX) ; port FLASH_WP

Not connected (* = marked no-connect by the designer): CN7003 A8(SBU1) B8(SBU2); U3000 A1(PTG10/GPIO[202]/FXIO_D2/EMIOS_0_CH[14]_H/EIRQ[26]) A6(PTF0/GPIO[160]/LPUART5_TX/EMIOS_2_CH[0]_X/LPSPI2_SCK/EIRQ[0]) A17(PTG11/GPIO[203]/FXIO_D3/EMIOS_0_CH[15]_H/EIRQ[27]) B6(PTF1/GPIO[161]/EMIOS_2_CH[1]_H/LPSPI2_SIN/LPUART5_RX/EIRQ[1]) B9(PTE22/GPIO[150]/EMIOS_1_CH[2]_H/EMIOS_2_CH[20]_Y/LPSPI4_SCK/ADC2_P4) B11(PTE6/GPIO[134]/LPSPI0_PCS2/LPUART1_RTS/EMIOS_1_CH[14]_H/LPUART10_TX/FXIO_D12/ADC0_MA[1]/EIRQ[6]/WKPU[29]/ADC1_P6) B15(PTF9/GPIO[169]/EMIOS_2_CH[9]_H/ADC0_MA[0]/EIRQ[17]) B17(PTF10/GPIO[170]/EMIOS_2_CH[10]_H/ADC0_MA[1]/EIRQ[18]) C4(PTE28/GPIO[156]/CAN3_TX/EMIOS_0_CH[11]_H) C5(PTE29/GPIO[157]/EMIOS_0_CH[12]_H/CAN3_RX) C7(PTF4/GPIO[164]/CAN5_TX/EMIOS_2_CH[4]_H/LPSPI2_SOUT/FXIO_D0/EIRQ[4]) C8(PTF5/GPIO[165]/EMIOS_2_CH[5]_H/CAN5_RX/EIRQ[5]) C9(PTF7/GPIO[167]/LPSPI2_PCS0/EMIOS_2_CH[7]_H/LPI2C1_SCL/FXIO_D1/EIRQ[7]) C10(PTE20/GPIO[148]/EMIOS_1_CH[0]_X) C11(PTE19/GPIO[147]/EMIOS_0_CH[22]_X) D5(PTE26/GPIO[154]/EMIOS_1_CH[6]_H/EMIOS_2_CH[6]_H/ADC2_P6) D7(PTF6/GPIO[166]/EMIOS_2_CH[6]_H/EIRQ[6]) D8(PTE23/GPIO[151]/EMIOS_1_CH[3]_H/EMIOS_2_CH[21]_Y/LPSPI4_PCS0/ADC2_P5/WKPU[57]) D10(PTF8/GPIO[168]/EMIOS_2_CH[8]_X/LPI2C1_SDA/FXIO_D2/EIRQ[16]) D11(PTE18/GPIO[146]/FXIO_D4/EMIOS_2_CH[17]_Y/WKPU[55]/ADC1_S23/ADC2_S11) D12(PTE17/GPIO[145]/FXIO_D5/EMIOS_2_CH[23]_X/ADC1_S22/ADC2_S10) E1(PTE11/GPIO[139]/LPUART4_TX/LPSPI2_PCS0/EMIOS_0_CH[1]_G/EMIOS_0_CH[21]_Y/FXIO_D5/TRGMUX_OUT5/EIRQ[10]/ADC0_P6/WKPU[28]) E14(PTF13/GPIO[173]/EMIOS_2_CH[13]_H/ADC0_MA[1]/LPSPI3_SCK/LPUART10_RX/EIRQ[21]) E15(PTF12/GPIO[172]/LPUART10_TX/EMIOS_2_CH[12]_H/ADC0_MA[0]/LPSPI3_SIN/EIRQ[20]) F2(PTE5/GPIO[133]/EMIOS_1_CH[5]_H/EMIOS_0_CH[19]_Y/FXIO_D7/LPUART12_RX/LPUART2_RX/EIRQ[5]/WKPU[32]/ADC2_S8) F4(PTG8/GPIO[200]/CAN4_TX/FXIO_D12/LPSPI5_PCS3/EMIOS_0_CH[13]_H/EIRQ[24]) F9(PTE21/GPIO[149]/EMIOS_1_CH[1]_H/EMIOS_2_CH[19]_Y/LPSPI4_SIN/ADC2_P3/WKPU[56]) F11(PTG26/GPIO[218]/FXIO_D25/EMIOS_0_CH[3]_G/CAN7_TX/TRACE_ETM_D14) F12(PTG25/GPIO[217]/LPSPI5_SOUT/FXIO_D24/EMIOS_0_CH[2]_G/TRACE_ETM_D13/LPUART12_RX/WKPU[45]) F14(PTF15/GPIO[175]/EMIOS_2_CH[15]_H/CMP0_RRT/LPSPI3_SOUT/FCCU_ERR1/CAN1_RX/FCCU_ERR_IN1/EIRQ[23]) F15(PTF14/GPIO[174]/CAN1_TX/EMIOS_2_CH[14]_H/CMP0_OUT/FCCU_ERR0/FXIO_D3/FCCU_ERR_IN0/EIRQ[22]) G2(PTG9/GPIO[201]/EMIOS_1_CH[5]_H/FXIO_D5/LPUART2_TX/CAN4_RX/EIRQ[25]) G3(PTG13/GPIO[205]/CAN5_TX/FXIO_D13/LPSPI5_PCS2/EMIOS_0_CH[17]_Y/EIRQ[29]) G6(PTE4/GPIO[132]/LPSPI0_PCS0/LPSPI1_PCS1/EMIOS_1_CH[4]_H/EMIOS_0_CH[18]_Y/LPUART12_TX/FXIO_D6/EIRQ[4]/ADC2_S9) G9(PTE27/GPIO[155]/EMIOS_1_CH[7]_H/EMIOS_0_CH[10]_H) G12(PTG24/GPIO[216]/LPUART12_TX/LPSPI5_PCS2/FXIO_D23/EMIOS_0_CH[1]_G/TRACE_ETM_D12) G14(PTF17/GPIO[177]/EMIOS_2_CH[17]_Y/EMIOS_1_CH[1]_H/ADC1_MA[1]/LPUART12_RX) G15(PTF16/GPIO[176]/LPUART12_TX/EMIOS_2_CH[16]_X/EMIOS_1_CH[0]_X/ADC1_MA[0]/LPSPI3_PCS0) H3(PTG14/GPIO[206]/LPSPI2_PCS0/LPSPI2_PCS2/EMIOS_0_CH[18]_Y/CAN5_RX/EIRQ[30]) H11(PTF11/GPIO[171]/EMIOS_2_CH[11]_H/ADC0_MA[2]/HSE_TAMPER_EXTIN0/EIRQ[19]) H12(PTG23/GPIO[215]/EMIOS_2_CH[23]_X/FXIO_D22/EMIOS_0_CH[0]_X/TRACE_ETM_D11/LPSPI5_PCS0) H14(PTF18/GPIO[178]/LPUART7_TX/EMIOS_2_CH[18]_Y/EMIOS_1_CH[2]_H/ADC1_MA[2]/LPSPI3_PCS1) J11(PTF19/GPIO[179]/EMIOS_2_CH[19]_Y/EMIOS_1_CH[3]_H/ADC0_MA[2]/LPSPI3_PCS2/HSE_TAMPER_LOOP_OUT0_/LPUART7_RX) J12(PTG22/GPIO[214]/EMIOS_2_CH[22]_X/FXIO_D21/TRACE_ETM_D10) K3(PTF30/GPIO[190]/EMIOS_1_CH[14]_H/ADC1_MA[1]/CAN3_RX) K6(PTG7/GPIO[199]/FXIO_D11/EMIOS_1_CH[23]_X/TRACE_ETM_D0/EIRQ[15]) K7(PTG6/GPIO[198]/FXIO_D10/EMIOS_1_CH[22]_X/TRACE_ETM_CLKOUT/EIRQ[14]) K12(PTG21/GPIO[213]/EMIOS_2_CH[21]_Y/FXIO_D20/TRACE_ETM_D9/CAN6_RX) L6(PTG15/GPIO[207]/FXIO_D14/EMIOS_2_CH[15]_H/TRACE_ETM_D1/EIRQ[31]) L9(PTF31/GPIO[191]/ADC1_MA[2]/EMIOS_1_CH[15]_H/FXIO_D9/TRACE_ETM_D3) M1(PTE12/GPIO[140]/CAN5_TX/LPUART2_TX/EMIOS_1_CH[5]_H/GMAC0_PPS3/FXIO_D8/FXIO_D7/SAI1_MCLK/EIRQ[11]) M8(PTG16/GPIO[208]/EMIOS_2_CH[16]_X/FXIO_D15/TRACE_ETM_D2) M9(PTG17/GPIO[209]/EMIOS_2_CH[17]_Y/FXIO_D16/TRACE_ETM_D4) M10(PTG18/GPIO[210]/EMIOS_2_CH[18]_Y/FXIO_D17/TRACE_ETM_D6) M11(PTG19/GPIO[211]/EMIOS_2_CH[19]_Y/FXIO_D18/TRACE_ETM_D7) M12(PTF24/GPIO[184]/EMIOS_1_CH[8]_X/LPUART9_RX) M14(PTF23/GPIO[183]/LPUART9_TX/EMIOS_2_CH[23]_X/EMIOS_1_CH[7]_H/LPSPI3_PCS3) M17(PTE7/GPIO[135]/EMIOS_0_CH[7]_G/LPSPI3_SCK/FXIO_D11/LPUART4_RX/ADC2_S20) P12(PTF25/GPIO[185]/CAN2_TX/EMIOS_1_CH[9]_H/LPSPI2_PCS2/LPSPI4_PCS0/FXIO_D6) R3(PTE9/GPIO[137]/LPSPI5_SOUT/EMIOS_0_CH[7]_G/EMIOS_1_CH[13]_H/CAN3_TX/GMAC0_PPS3/GMAC0_MII_RMII_TX_EN/FXIO_D11/LPUART2_CTS/SAI0_MCLK/EIRQ[8]/CMP0_IN0) R4(PTE8/GPIO[136]/LPSPI3_PCS1/EMIOS_0_CH[6]_G/LPSPI5_PCS1/FXIO_D12/GMAC0_MII_RMII_RGMII_MDC/SAI1_BCLK/FXIO_D8/EIRQ[7]/CMP0_IN3) U16(PTF22/GPIO[182]/EMIOS_2_CH[22]_X/EMIOS_1_CH[6]_H/LPSPI4_PCS2); U7003 4(RST#)* 5(CTS#)* 6(TNOW)*

### Notes on the sheet
- TITLE:
- PROJECT:
- Design by:
- Check by:
- Approve by:
- DRAWING NUMBER:
- REVISION:
- SIZE: A3
- SHEET NUMBER
- OFF
- DATE:

### Library data of the parts
C7022 = CMP-00045-5: CAP CER 10uF 16V 10% X7R 1206 SMD; Manufacturer 1: Samsung; Crossable(YES/NO): YES; Ratings: AEC-Q200; Packaging: Tape and Reel; Thickness: 0.071inch; Min Operating Temperature: -55°C; Case Code (Metric): 3216; Max Operating Temperature: 125°C; Mount: Surface Mount; Length: 0.126inch; Dielectric: X7R; Tolerance: 10%; Width: 0.063inch; Case Code (Imperial): 1206; Manufacturer Part Number 1: CL31B106KOHVPNE; Features: Soft Termination; Mount Type(SMD/TH): SMD; Height: 1.6mm; Lead Free: Lead Free; Voltage Rating (DC): 16V
C7023 = CMP-01106-1: CAP CER 1UF 10V X6S 0402; Manufacturer: Samsung; Capacitor Type: Ceramic; Multilayer: Yes; Tolerance  (fill in as +-): 10%; Max Operating Temperature: 105°C; Category: Ceramic Capacitors; Dielectric Material: Ceramic; Height: 0.55mm; JESD-609 Code: e3; Length: 1mm; Manufacturer Part Number: CL05X105KP5NNNC; Min Operating Temperature: -55°C; Mounting Technology: Surface Mount; Pins: 2; Package Shape: Rectangular; Package Style: SMTMeter; Packaging: Tape and Reel; Tolerance (fill in as +-): 10%; Reach SVHC Compliant: Yes; RoHS Compliant: Yes; Temperature Characteristics Code: X6S; Terminal Finish: Nickel; Termination: Wraparound; Width: 0.5mm
C7024 = CMP-00988-1: as C3002 on sheet 06- MCU PORTA_B; Case Code (Imperial): 0402; Case Code (Metric): 1005; Dielectric: X7R; Manufacturer Part Number 1: 0402YC104KAT2A; Max Operating Temperature: 125°C; Min Operating Temperature: -55°C; Mount: Surface Mount; Voltage Rating: 16V
CN7003 = CMP-01116-1: CONN RCP USB2.0 TYP C 24P SMD RA; Manufacturer: Amphenol; Manufacturer Part Number: 12402012E212A; Category: Connectors
D7003 = CMP-00015-4: DIODE SCHOTTKY 40V 3A SMA; Manufacturer: onsemi; Additional Feature: FREE WHEELING DIODE; Application(s): POWER; Diode Element Material: SILICON; Diode Type: RECTIFIER; Forward Voltage: 390mV; Non-rep Pk Forward Current-Max: 100A; Number of Elements: 1; Package Body Material: Plastic; Qualification Status: Not Qualified; Time @ Peak Reflow Temperature-Max (s): 40s; ComponentLink1URL: https://datasheet.ciiva.com/30479/0900766b812212c7-30479618.pdf?src-supplier=RSComponents; ComponentLink1Description: https://datasheet.ciiva.com/30479/0900766b812212c7-30479618.pdf?src-supplier=RSComponents; ComponentLink2URL: https://datasheet.ciiva.com/923/mbra340t3-d-923224.pdf?src-supplier=Digi-Key; ComponentLink2Description: https://datasheet.ciiva.com/923/mbra340t3-d-923224.pdf?src-supplier=Digi-Key; ComponentLink3URL: https://datasheet.ciiva.com/8294/mbra340t3-d-8294077.pdf?src-supplier=Avnet; ComponentLink3Description: https://datasheet.ciiva.com/8294/mbra340t3-d-8294077.pdf?src-supplier=Avnet; Category: Schottky Diodes; JESD-30 Code: R-PDSO-C2; JESD-609 Code: e3; Manufacturer Part Number: MBRA340T3G; Max Operating Temperature: 150°C; Max Output current: 3A; Min Operating Temperature: -55°C; Moisture Sensitivity Level: 1; Number of Phases: 1; Pins: 2; Package Shape: Rectangular; Package Style: SMALL OUTLINEMeter; Peak Reflow Temperature (Cel): 260°C; Reach SVHC Compliant: No; Rep Pk Reverse Voltage-Max: 40V; RoHS Compliant: Yes; Surface Mount: Yes; Technology: SCHOTTKY; Terminal Finish: Tin; Terminal Form: C BEND; Terminal Position: DUAL
J7000 = CMP-00025-12: CONN HEADER VERT 4POS 2.54MM; Manufacturer 1: Wurth Electronics; Number of Positions: 4; Mount Type(SMD/TH): TH; Gender: Male; Pitch: 0.1inch; Connector Type: Male Pin; Crossable(YES/NO): YES; Contact Material: Copper; Manufacturer Part Number 1: 61300411121; Contact Plating: Gold; Contact Mating Length: 0.236inch; REACH SVHC: Unknown; Operating Temperature: -40°C ~ 105°C; Mount: Through Hole; Number of Contacts: 4; Lead Free: Lead Free; Packaging: Bulk; Number of Rows: 1; Termination: Solder; Color: Black; Max Operating Temperature: 105°C; Min Operating Temperature: -40°C
R7015 = CMP-00083-6: RES 0R 1/4W 5% 1206 SMD; Manufacturer 1: Yageo; Max Power Dissipation: 250mW; Crossable(YES/NO): YES; Temperature Coefficient: 200ppm/°C; Voltage Rating: 200V; Length: 0.122inch; Features: Moisture Resistant,Automotive AEC-Q200; Tolerance: 5%; Package Quantity: 5000; Height: 0.026inch; Min Operating Temperature: -55°C; Mount Type(SMD/TH): SMD; Case Code (Imperial): 1206; Composition: Thick Film; Number of Terminations: 2; Termination: SMD/SMT; Packaging: Tape and Reel; Power Rating: 250mW; Width: 0.063inch; Manufacturer Part Number 1: AC1206JR-070RL; Max Operating Temperature: 155°C; Lead Free: Lead Free; Case Code (Metric): 3216
R7018 R7019 = CMP-00289-1: RES SMD 5.1K OHM 1% 1/16W 0402; Manufacturer 1: Rohm Semiconductor; Crossable(YES/NO): YES; Max Power Dissipation: 63mW; Voltage Rating (DC): 50V; Temperature Coefficient: 400ppm/°C; Width: 0.02inch; Number of Terminations: 2; Min Operating Temperature: -55°C; Mount Type(SMD/TH): SMD; Case Code (Metric): 1005; Depth: 0.5mm; Max Operating Temperature: 155°C; Composition: Thick Film; Features: Automotive AEC-Q200; Height: 0.016inch; Packaging: Tape and Reel; Package Quantity: 10000; Length: 0.039inch; Tolerance: 1%; Lead Free: Lead Free; Case Code (Imperial): 0402; Manufacturer Part Number 1: MCR01MZPF5101; Military Standard: Not
U3000 = CMP-01150-1: as U3000 on sheet 07-MCU PORTC_D; Category: Microcontrollers; Manufacturer Part Number: S32K388HHT0MJBSR
U7003 = CMP-01117-1: USB TO UART IC

## Sheet 09- CAN.SchDoc: CAN
size 420 x 297 mm; Revision: 1.0; SheetNumber: 9; SheetTotal: 13; Project: LOW LEVEL ECU
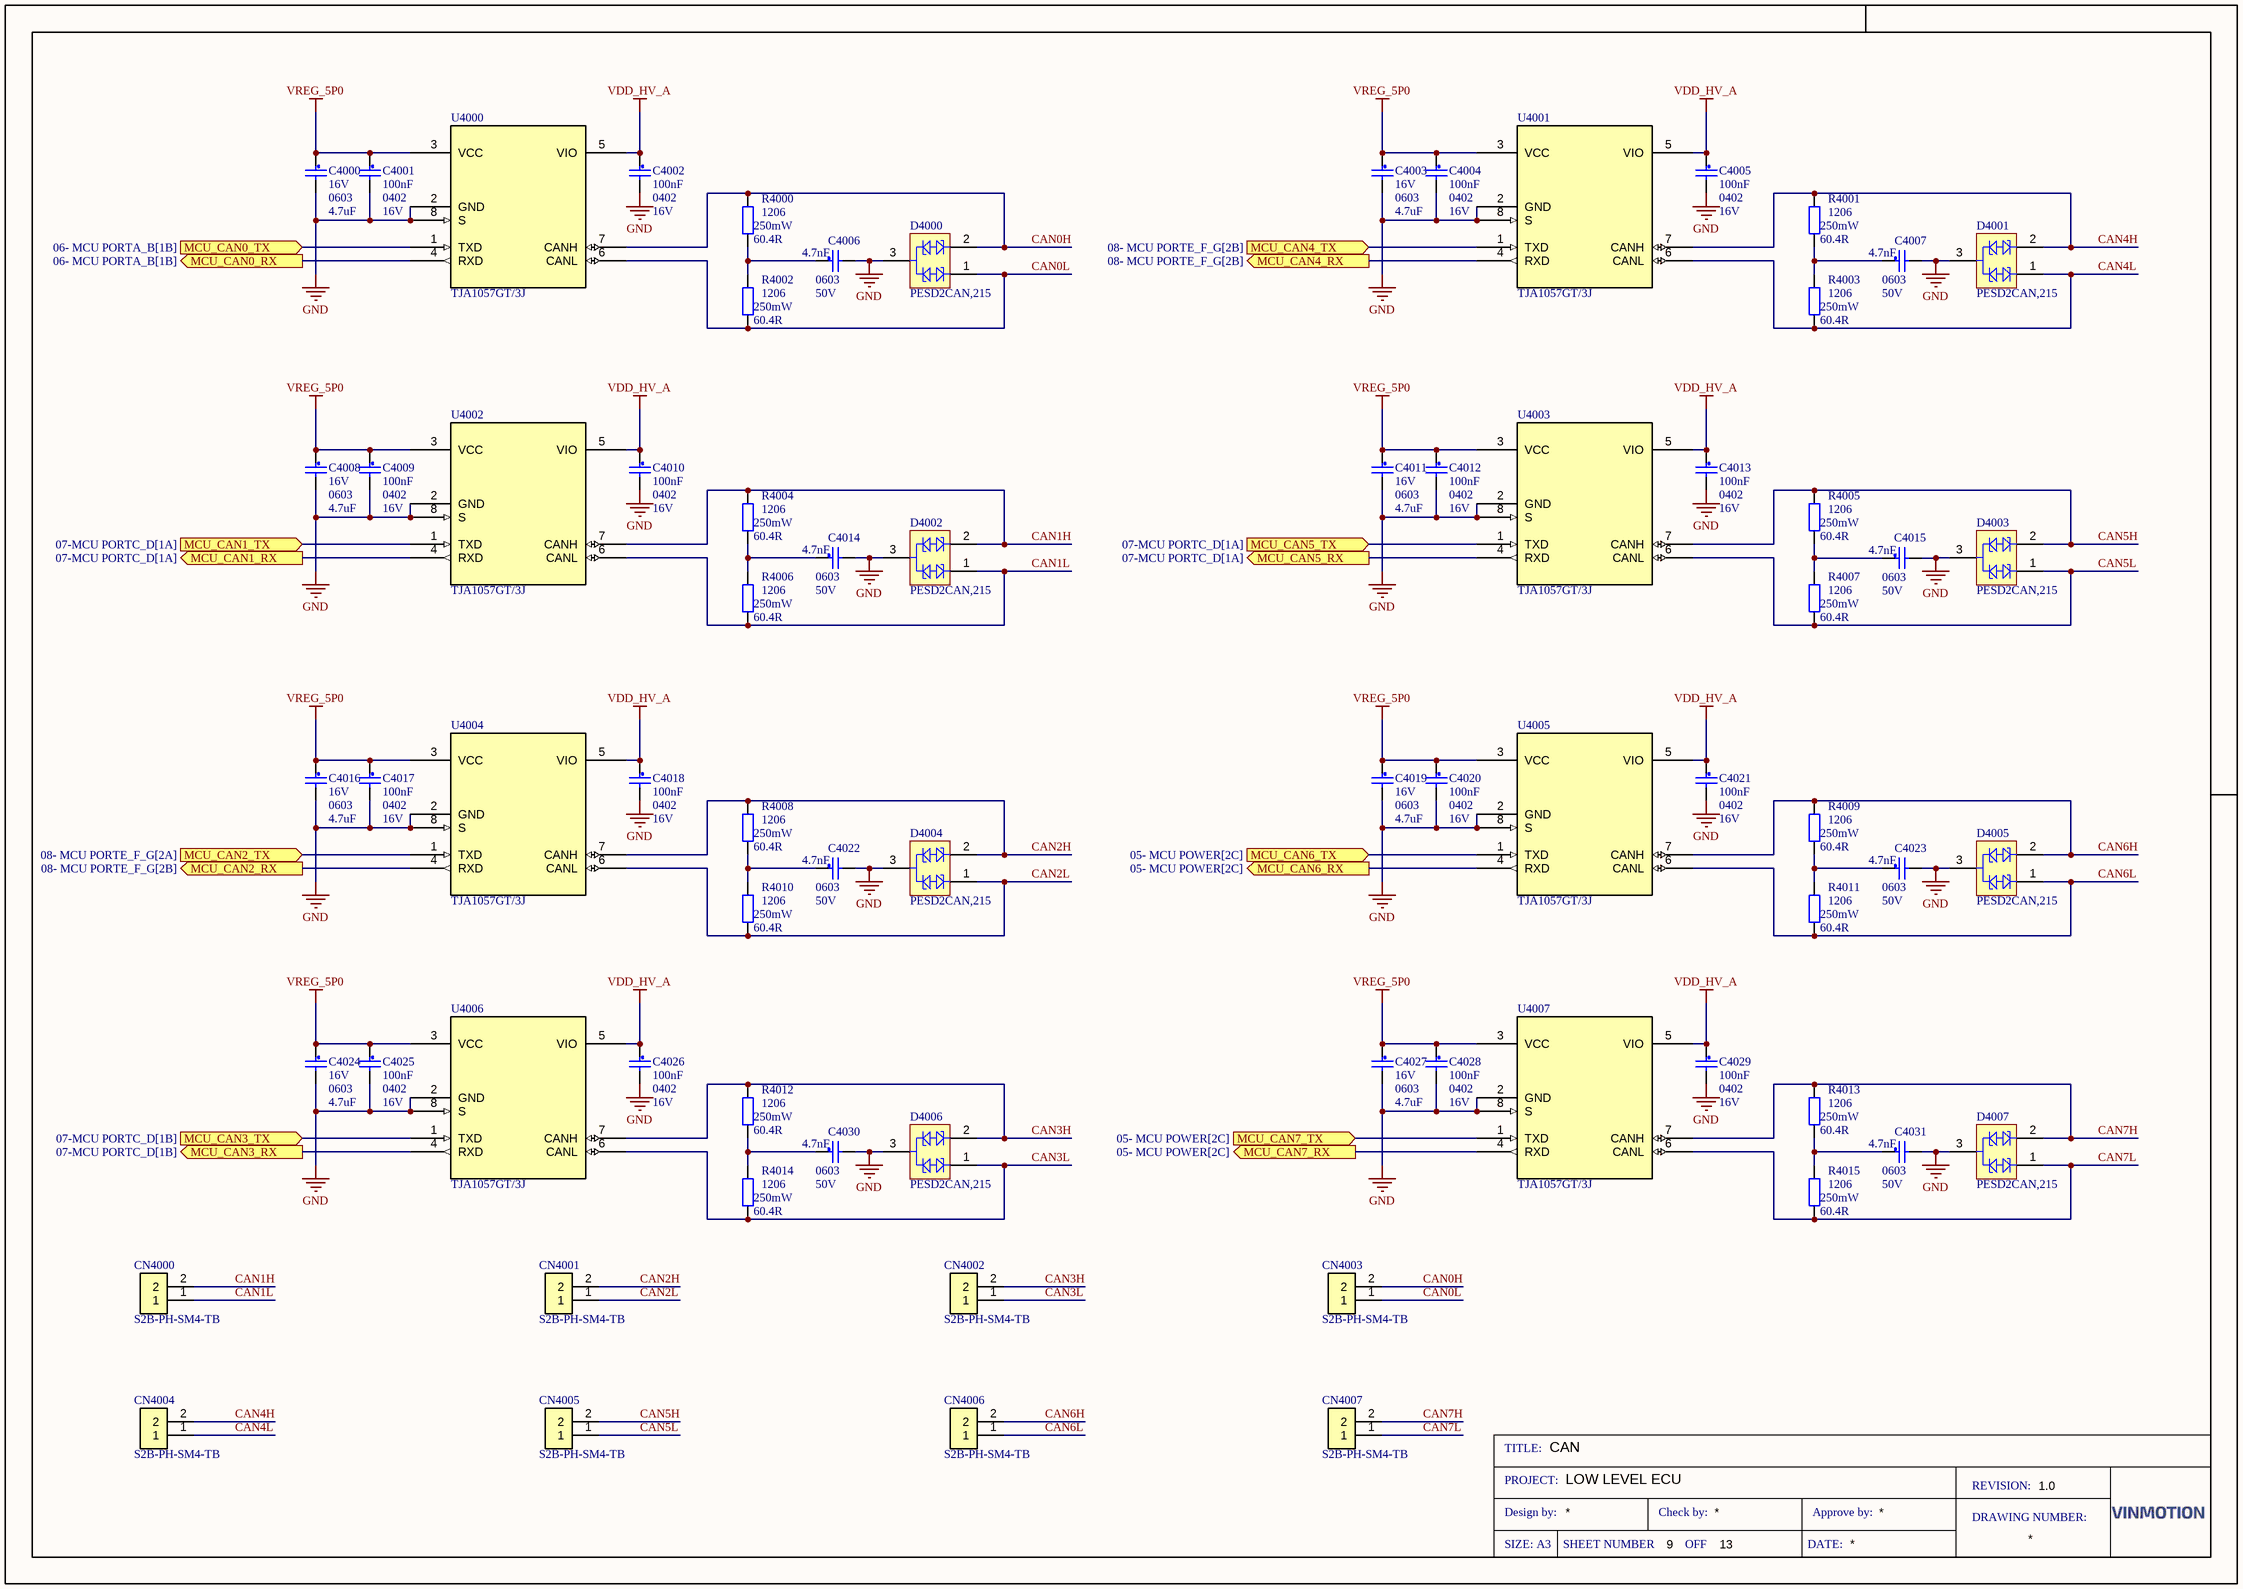
[diagram p7: 09- CAN.SchDoc]

### Parts
C4000  Voltage Rating: 16V  Case/Package: 0603  Capacitance: 4.7uF  [CAP0603]  (hidden comment: GRT188C81C475KE13D)
C4001  Capacitance: 100nF  Case/Package: 0402  Voltage Rating (DC): 16V  [CAP0402]  (hidden comment: 0402YC104KAT2A)
C4002  Capacitance: 100nF  Case/Package: 0402  Voltage Rating (DC): 16V  [CAP0402]  (hidden comment: 0402YC104KAT2A)
C4003  Voltage Rating: 16V  Case/Package: 0603  Capacitance: 4.7uF  [CAP0603]  (hidden comment: GRT188C81C475KE13D)
C4004  Capacitance: 100nF  Case/Package: 0402  Voltage Rating (DC): 16V  [CAP0402]  (hidden comment: 0402YC104KAT2A)
C4005  Capacitance: 100nF  Case/Package: 0402  Voltage Rating (DC): 16V  [CAP0402]  (hidden comment: 0402YC104KAT2A)
C4006  Case Code (Imperial): 0603  Voltage Rating: 50V  Capacitance: 4.7nF  [CAP0603]  (hidden comment: CL10B472KB8WPNC)
C4007  Case Code (Imperial): 0603  Voltage Rating: 50V  Capacitance: 4.7nF  [CAP0603]  (hidden comment: CL10B472KB8WPNC)
C4008  Voltage Rating: 16V  Case/Package: 0603  Capacitance: 4.7uF  [CAP0603]  (hidden comment: GRT188C81C475KE13D)
C4009  Capacitance: 100nF  Case/Package: 0402  Voltage Rating (DC): 16V  [CAP0402]  (hidden comment: 0402YC104KAT2A)
C4010  Capacitance: 100nF  Case/Package: 0402  Voltage Rating (DC): 16V  [CAP0402]  (hidden comment: 0402YC104KAT2A)
C4011  Voltage Rating: 16V  Case/Package: 0603  Capacitance: 4.7uF  [CAP0603]  (hidden comment: GRT188C81C475KE13D)
C4012  Capacitance: 100nF  Case/Package: 0402  Voltage Rating (DC): 16V  [CAP0402]  (hidden comment: 0402YC104KAT2A)
C4013  Capacitance: 100nF  Case/Package: 0402  Voltage Rating (DC): 16V  [CAP0402]  (hidden comment: 0402YC104KAT2A)
C4014  Case Code (Imperial): 0603  Voltage Rating: 50V  Capacitance: 4.7nF  [CAP0603]  (hidden comment: CL10B472KB8WPNC)
C4015  Case Code (Imperial): 0603  Voltage Rating: 50V  Capacitance: 4.7nF  [CAP0603]  (hidden comment: CL10B472KB8WPNC)
C4016  Voltage Rating: 16V  Case/Package: 0603  Capacitance: 4.7uF  [CAP0603]  (hidden comment: GRT188C81C475KE13D)
C4017  Capacitance: 100nF  Case/Package: 0402  Voltage Rating (DC): 16V  [CAP0402]  (hidden comment: 0402YC104KAT2A)
C4018  Capacitance: 100nF  Case/Package: 0402  Voltage Rating (DC): 16V  [CAP0402]  (hidden comment: 0402YC104KAT2A)
C4019  Voltage Rating: 16V  Case/Package: 0603  Capacitance: 4.7uF  [CAP0603]  (hidden comment: GRT188C81C475KE13D)
C4020  Capacitance: 100nF  Case/Package: 0402  Voltage Rating (DC): 16V  [CAP0402]  (hidden comment: 0402YC104KAT2A)
C4021  Capacitance: 100nF  Case/Package: 0402  Voltage Rating (DC): 16V  [CAP0402]  (hidden comment: 0402YC104KAT2A)
C4022  Case Code (Imperial): 0603  Voltage Rating: 50V  Capacitance: 4.7nF  [CAP0603]  (hidden comment: CL10B472KB8WPNC)
C4023  Case Code (Imperial): 0603  Voltage Rating: 50V  Capacitance: 4.7nF  [CAP0603]  (hidden comment: CL10B472KB8WPNC)
C4024  Voltage Rating: 16V  Case/Package: 0603  Capacitance: 4.7uF  [CAP0603]  (hidden comment: GRT188C81C475KE13D)
C4025  Capacitance: 100nF  Case/Package: 0402  Voltage Rating (DC): 16V  [CAP0402]  (hidden comment: 0402YC104KAT2A)
C4026  Capacitance: 100nF  Case/Package: 0402  Voltage Rating (DC): 16V  [CAP0402]  (hidden comment: 0402YC104KAT2A)
C4027  Voltage Rating: 16V  Case/Package: 0603  Capacitance: 4.7uF  [CAP0603]  (hidden comment: GRT188C81C475KE13D)
C4028  Capacitance: 100nF  Case/Package: 0402  Voltage Rating (DC): 16V  [CAP0402]  (hidden comment: 0402YC104KAT2A)
C4029  Capacitance: 100nF  Case/Package: 0402  Voltage Rating (DC): 16V  [CAP0402]  (hidden comment: 0402YC104KAT2A)
C4030  Case Code (Imperial): 0603  Voltage Rating: 50V  Capacitance: 4.7nF  [CAP0603]  (hidden comment: CL10B472KB8WPNC)
C4031  Case Code (Imperial): 0603  Voltage Rating: 50V  Capacitance: 4.7nF  [CAP0603]  (hidden comment: CL10B472KB8WPNC)
CN4000  S2B-PH-SM4-TB  [S2B-PH-SM4-TB]
CN4001  S2B-PH-SM4-TB  [S2B-PH-SM4-TB]
CN4002  S2B-PH-SM4-TB  [S2B-PH-SM4-TB]
CN4003  S2B-PH-SM4-TB  [S2B-PH-SM4-TB]
CN4004  S2B-PH-SM4-TB  [S2B-PH-SM4-TB]
CN4005  S2B-PH-SM4-TB  [S2B-PH-SM4-TB]
CN4006  S2B-PH-SM4-TB  [S2B-PH-SM4-TB]
CN4007  S2B-PH-SM4-TB  [S2B-PH-SM4-TB]
D4000  PESD2CAN,215  [NEXPERIA_PESD2CAN,215_N]
D4001  PESD2CAN,215  [NEXPERIA_PESD2CAN,215_N]
D4002  PESD2CAN,215  [NEXPERIA_PESD2CAN,215_N]
D4003  PESD2CAN,215  [NEXPERIA_PESD2CAN,215_N]
D4004  PESD2CAN,215  [NEXPERIA_PESD2CAN,215_N]
D4005  PESD2CAN,215  [NEXPERIA_PESD2CAN,215_N]
D4006  PESD2CAN,215  [NEXPERIA_PESD2CAN,215_N]
D4007  PESD2CAN,215  [NEXPERIA_PESD2CAN,215_N]
R4000  Max Power Dissipation: 250mW  Resistance: 60.4R  Case/Package: 1206  [RES1206]  (hidden comment: RMCF1206FT60R4)
R4001  Max Power Dissipation: 250mW  Resistance: 60.4R  Case/Package: 1206  [RES1206]  (hidden comment: RMCF1206FT60R4)
R4002  Max Power Dissipation: 250mW  Resistance: 60.4R  Case/Package: 1206  [RES1206]  (hidden comment: RMCF1206FT60R4)
R4003  Max Power Dissipation: 250mW  Resistance: 60.4R  Case/Package: 1206  [RES1206]  (hidden comment: RMCF1206FT60R4)
R4004  Max Power Dissipation: 250mW  Resistance: 60.4R  Case/Package: 1206  [RES1206]  (hidden comment: RMCF1206FT60R4)
R4005  Max Power Dissipation: 250mW  Resistance: 60.4R  Case/Package: 1206  [RES1206]  (hidden comment: RMCF1206FT60R4)
R4006  Max Power Dissipation: 250mW  Resistance: 60.4R  Case/Package: 1206  [RES1206]  (hidden comment: RMCF1206FT60R4)
R4007  Max Power Dissipation: 250mW  Resistance: 60.4R  Case/Package: 1206  [RES1206]  (hidden comment: RMCF1206FT60R4)
R4008  Max Power Dissipation: 250mW  Resistance: 60.4R  Case/Package: 1206  [RES1206]  (hidden comment: RMCF1206FT60R4)
R4009  Max Power Dissipation: 250mW  Resistance: 60.4R  Case/Package: 1206  [RES1206]  (hidden comment: RMCF1206FT60R4)
R4010  Max Power Dissipation: 250mW  Resistance: 60.4R  Case/Package: 1206  [RES1206]  (hidden comment: RMCF1206FT60R4)
R4011  Max Power Dissipation: 250mW  Resistance: 60.4R  Case/Package: 1206  [RES1206]  (hidden comment: RMCF1206FT60R4)
R4012  Max Power Dissipation: 250mW  Resistance: 60.4R  Case/Package: 1206  [RES1206]  (hidden comment: RMCF1206FT60R4)
R4013  Max Power Dissipation: 250mW  Resistance: 60.4R  Case/Package: 1206  [RES1206]  (hidden comment: RMCF1206FT60R4)
R4014  Max Power Dissipation: 250mW  Resistance: 60.4R  Case/Package: 1206  [RES1206]  (hidden comment: RMCF1206FT60R4)
R4015  Max Power Dissipation: 250mW  Resistance: 60.4R  Case/Package: 1206  [RES1206]  (hidden comment: RMCF1206FT60R4)
U4000  TJA1057GT/3J  [SOIC127P590X175-8N]
U4001  TJA1057GT/3J  [SOIC127P590X175-8N]
U4002  TJA1057GT/3J  [SOIC127P590X175-8N]
U4003  TJA1057GT/3J  [SOIC127P590X175-8N]
U4004  TJA1057GT/3J  [SOIC127P590X175-8N]
U4005  TJA1057GT/3J  [SOIC127P590X175-8N]
U4006  TJA1057GT/3J  [SOIC127P590X175-8N]
U4007  TJA1057GT/3J  [SOIC127P590X175-8N]

### Ports
MCU_CAN0_RX (out, see 06- MCU PORTA_B[1B]), MCU_CAN0_TX (in, see 06- MCU PORTA_B[1B]), MCU_CAN1_RX (out, see 07-MCU PORTC_D[1A]), MCU_CAN1_TX (in, see 07-MCU PORTC_D[1A]), MCU_CAN2_RX (out, see 08- MCU PORTE_F_G[2B]), MCU_CAN2_TX (in, see 08- MCU PORTE_F_G[2A]), MCU_CAN3_RX (out, see 07-MCU PORTC_D[1B]), MCU_CAN3_TX (in, see 07-MCU PORTC_D[1B]), MCU_CAN4_RX (out, see 08- MCU PORTE_F_G[2B]), MCU_CAN4_TX (in, see 08- MCU PORTE_F_G[2B]), MCU_CAN5_RX (out, see 07-MCU PORTC_D[1A]), MCU_CAN5_TX (in, see 07-MCU PORTC_D[1A]), MCU_CAN6_RX (out, see 05- MCU POWER[2C]), MCU_CAN6_TX (in, see 05- MCU POWER[2C]), MCU_CAN7_RX (out, see 05- MCU POWER[2C]), MCU_CAN7_TX (in, see 05- MCU POWER[2C])

### Nets
GND: C4000.2 C4001.2 C4002.2 C4003.2 C4004.2 C4005.2 C4006.2 C4007.2 C4008.2 C4009.2 C4010.2 C4011.2 C4012.2 C4013.2 C4014.2 C4015.2 C4016.2 C4017.2 C4018.2 C4019.2 C4020.2 C4021.2 C4022.2 C4023.2 C4024.2 C4025.2 C4026.2 C4027.2 C4028.2 C4029.2 C4030.2 C4031.2 D4000.3 D4001.3 D4002.3 D4003.3 D4004.3 D4005.3 D4006.3 D4007.3 U4000.2(GND) U4000.8(S) U4001.2(GND) U4001.8(S) U4002.2(GND) U4002.8(S) U4003.2(GND) U4003.8(S) U4004.2(GND) U4004.8(S) U4005.2(GND) U4005.8(S) U4006.2(GND) U4006.8(S) U4007.2(GND) U4007.8(S)
VDD_HV_A: C4002.1 C4005.1 C4010.1 C4013.1 C4018.1 C4021.1 C4026.1 C4029.1 U4000.5(VIO) U4001.5(VIO) U4002.5(VIO) U4003.5(VIO) U4004.5(VIO) U4005.5(VIO) U4006.5(VIO) U4007.5(VIO)
VREG_5P0: C4000.1 C4001.1 C4003.1 C4004.1 C4008.1 C4009.1 C4011.1 C4012.1 C4016.1 C4017.1 C4019.1 C4020.1 C4024.1 C4025.1 C4027.1 C4028.1 U4000.3(VCC) U4001.3(VCC) U4002.3(VCC) U4003.3(VCC) U4004.3(VCC) U4005.3(VCC) U4006.3(VCC) U4007.3(VCC)
CAN0H: CN4003.2 D4000.2 R4000.1 U4000.7(CANH)
CAN0L: CN4003.1 D4000.1 R4002.2 U4000.6(CANL)
CAN1H: CN4000.2 D4002.2 R4004.1 U4002.7(CANH)
CAN1L: CN4000.1 D4002.1 R4006.2 U4002.6(CANL)
CAN2H: CN4001.2 D4004.2 R4008.1 U4004.7(CANH)
CAN2L: CN4001.1 D4004.1 R4010.2 U4004.6(CANL)
CAN3H: CN4002.2 D4006.2 R4012.1 U4006.7(CANH)
CAN3L: CN4002.1 D4006.1 R4014.2 U4006.6(CANL)
CAN4H: CN4004.2 D4001.2 R4001.1 U4001.7(CANH)
CAN4L: CN4004.1 D4001.1 R4003.2 U4001.6(CANL)
CAN5H: CN4005.2 D4003.2 R4005.1 U4003.7(CANH)
CAN5L: CN4005.1 D4003.1 R4007.2 U4003.6(CANL)
CAN6H: CN4006.2 D4005.2 R4009.1 U4005.7(CANH)
CAN6L: CN4006.1 D4005.1 R4011.2 U4005.6(CANL)
CAN7H: CN4007.2 D4007.2 R4013.1 U4007.7(CANH)
CAN7L: CN4007.1 D4007.1 R4015.2 U4007.6(CANL)
NetC4006_1: C4006.1 R4000.2 R4002.1
NetC4007_1: C4007.1 R4001.2 R4003.1
NetC4014_1: C4014.1 R4004.2 R4006.1
NetC4015_1: C4015.1 R4005.2 R4007.1
NetC4022_1: C4022.1 R4008.2 R4010.1
NetC4023_1: C4023.1 R4009.2 R4011.1
NetC4030_1: C4030.1 R4012.2 R4014.1
NetC4031_1: C4031.1 R4013.2 R4015.1
NetU3000_A4: U4001.1(TXD) ; port MCU_CAN4_TX
NetU3000_A8: U4004.1(TXD) ; port MCU_CAN2_TX
NetU3000_B4: U4001.4(RXD) ; port MCU_CAN4_RX
NetU3000_B8: U4004.4(RXD) ; port MCU_CAN2_RX
NetU3000_E7: U4005.1(TXD) ; port MCU_CAN6_TX
NetU3000_E8: U4005.4(RXD) ; port MCU_CAN6_RX
NetU3000_E10: U4007.1(TXD) ; port MCU_CAN7_TX
NetU3000_E11: U4007.4(RXD) ; port MCU_CAN7_RX
NetU3000_M15: U4000.4(RXD) ; port MCU_CAN0_RX
NetU3000_M16: U4000.1(TXD) ; port MCU_CAN0_TX
NetU3000_N14: U4002.4(RXD) ; port MCU_CAN1_RX
NetU3000_N15: U4002.1(TXD) ; port MCU_CAN1_TX
NetU3000_N16: U4006.4(RXD) ; port MCU_CAN3_RX
NetU3000_P17: U4006.1(TXD) ; port MCU_CAN3_TX
NetU3000_T15: U4003.4(RXD) ; port MCU_CAN5_RX
NetU3000_T17: U4003.1(TXD) ; port MCU_CAN5_TX

### Notes on the sheet
- TITLE:
- PROJECT:
- Design by:
- Check by:
- Approve by:
- DRAWING NUMBER:
- REVISION:
- SIZE: A3
- SHEET NUMBER
- OFF
- DATE:

### Library data of the parts
C4000 C4003 C4008 C4011 C4016 C4019 C4024 C4027 = CMP-00351-2: CAP CER 4.7uF 16V 10% X6S 0603 SMD; Manufacturer 1: Murata Electronics; Crossable(YES/NO): YES; Case Code (Imperial): 0603; Tolerance: 10%; Packaging: Tape and Reel; Width: 0.031inch; Case Code (Metric): 1608; Mount Type(SMD/TH): SMD; Min Operating Temperature: -55°C; Max Operating Temperature: 105°C; Mount: Surface Mount; Thickness: 0.035inch; Manufacturer Part Number 1: GRT188C81C475KE13D; Ratings: AEC-Q200; Length: 0.063inch; Height: 0.8mm; Lead Free: Lead Free; Voltage Rating (DC): 16V
C4001 C4002 C4004 C4005 C4009 C4010 C4012 C4013 C4017 C4018 C4020 C4021 C4025 C4026 C4028 C4029 = CMP-00988-1: CAP CER 0.1UF 16V X7R 0402; Manufacturer 1: KYOCERA AVX; Crossable(YES/NO): YES; Mount Type(SMD/TH): SMD; Case Code (Imperial): 0402; Case Code (Metric): 1005; Dielectric: X7R; Manufacturer Part Number 1: 0402YC104KAT2A; Max Operating Temperature: 125°C; Min Operating Temperature: -55°C; Mount: Surface Mount; Voltage Rating: 16V
C4006 C4007 C4014 C4015 C4022 C4023 C4030 C4031 = CMP-00892-1: CAP CER 4700PF 50V X7R 0603; Manufacturer 1: Samsung; Tolerance: 10%; Crossable(YES/NO): YES; Mount Type(SMD/TH): SMD; Supplier 1: Digi-Key; Manufacturer Part Number 1: CL10B472KB8WPNC; Stock 1: 165107; Pricing 1: 1=0.10000, 10=0.04900, 100=0.02180, 500=0.01558, 1000=0.01224 (USD); RoHS: Yes; Mount: Surface Mount; Case/Package: 0603; Case Code (Metric): 1608; Min Operating Temperature: -55°C; Max Operating Temperature: 125°C; Features: Soft Termination; Packaging: Tape and Reel; Length: 0.063inch; Width: 0.031inch; Thickness: 0.035inch; Ratings: AEC-Q200; ComponentLink1URL: http://www.samsungsem.com/kr/support/library/product-catalog/mlcc.jsp?src-supplier=Digi-Key; ComponentLink1Description: http://www.samsungsem.com/kr/support/library/product-catalog/mlcc.jsp?src-supplier=Digi-Key; ComponentLink2URL: http://www.samsungsem.com/servlet/FileDownload?filename=productcatalog/pdf/MLCC.pdf&src-supplier=Avnet; ComponentLink2Description: http://www.samsungsem.com/servlet/FileDownload?filename=productcatalog/pdf/MLCC.pdf&src-supplier=Avnet; Supplier Part Number 1: 1276-6532-1-ND; Height: 0.8mm; Lead Free: Lead Free; Voltage Rating (DC): 50V
CN4000-CN4007 = CMP-01142-1: CONN HEADER SMD R/A 2POS 2MM; Manufacturer: JST; Manufacturer Part Number: S2BPHSM4TBLFSN; Current Rating: 2A; Insulation Resistance: 1GΩ; Number of Contacts: 2; Voltage Rating: 100V; Housing Color: Natural; Category: Headers and Wire Housings; Color: White; Contact Material: Copper, Tin; Contact Plating: Tin; Height: 5.5mm; Housing Material: Nylon; Lead Free: Lead Free; Lead Pitch: 2mm; Max Operating Temperature: 85°C; Min Operating Temperature: -25°C; Number of Positions: 2; Number of Rows: 1; RoHS: Compliant; Voltage Rating (AC): 100V
D4000-D4007 = CMP-ROOT-0006-8: DIODE TVS 24VWM 41VC SOT-23-3; Manufacturer 1: Nexperia USA Inc.; Min Breakdown Voltage: 26.2V; Breakdown Voltage: 28V; Test Current: 1mA; Number of Bidirectional Channels: 2; Reverse Standoff Voltage: 24V; Max Breakdown Voltage: 30.3V; ESD Protection: Yes; Peak Pulse Current: 5A; Mount Type(SMD/TH): SMD; Direction: Bidirectional; Max Reverse Leakage Current: 10nA; Element Configuration: Dual; Max Power Dissipation: 230W; Power Line Protection: No; Leakage Current: 50nA; Clamping Voltage: 41V; Capacitance: 17pF; Radiation Hardening: No; Manufacturer Part Number 1: PESD2CAN,215; Lead Free: Lead Free; Max Operating Temperature: 150°C; Mount: Surface Mount; REACH SVHC: No SVHC; Crossable(YES/NO): YES; Termination: SMD/SMT; Number of Elements: 2; Weight: 0.01lb; Contact Plating: Tin; Number of Channels: 2; Depth: 1.4mm; Packaging: Tape and Reel; Length: 3mm; Height: 1mm; Case/Package: SOT-23; Composition: Zener; Peak Pulse Power: 230W; Number of Pins: 3; Reverse Breakdown Voltage: 26.2V; Working Voltage: 24V; Max Surge Current: 5A; Min Operating Temperature: -65°C; Polarity: Bidirectional; Package Quantity: 1; Width: 1.4mm
R4000-R4015 = CMP-00099-3: RES 60.4R 1/4W 1% 1206 SMD; Manufacturer 1: Stackpole Electronics Inc; Temperature Coefficient: 100ppm/°C; Crossable(YES/NO): YES; Packaging: Tape and Reel; Number of Terminations: 2; Mount: Surface Mount; Width: 0.063inch; Features: Automotive AEC-Q200; Contact Plating: Tin,Matte; Manufacturer Part Number 1: RMCF1206FT60R4; Min Operating Temperature: -55°C; Height: 0.028inch; Mount Type(SMD/TH): SMD; Radiation Hardening: No; Case Code (Imperial): 1206; Max Operating Temperature: 155°C; Length: 0.126inch; Composition: Thick Film; Tolerance: 1%; Case Code (Metric): 3216
U4000-U4007 = CMP-01192-1: 1/1 Transceiver Half CANbus 8-SO; Manufacturer: NXP Semiconductors; Interface: CAN, LIN; Max Junction Temperature (Tj): 150°C; Max Supply Voltage: 5.25V; Min Supply Voltage: 4.75V; Number of Circuits: 1; Operating Supply Voltage: 5V; Receiver Hysteresis: 300mV; Simplex/Duplex: Half Duplex; Category: CAN Transceivers; Case/Package: SOIC; Height: 1.75mm; Height - Seated (Max): 1.75mm; Length: 4.9mm; Lifecycle Status: NRND; Manufacturer Part Number: TJA1057GT/3J; Max Operating Temperature: 150°C; Min Operating Temperature: -40°C; Mounting Technology: Surface Mount; Number of Terminals: 8; Packaging: Cut Tape; REACH SVHC: Yes; RoHS: Compliant; Schedule B: 8542390000, 8542390000|8542390000|8542390000|8542390000|8542390000; Terminal Pitch: 1.27mm; Width: 3.9mm